# Altium project PROC101D_SCH_With_Design_Updates..Notes_V1.0.PrjPcb (part 10 of 23)

## Sheet 23.SchDoc
size 513 x 386 mm
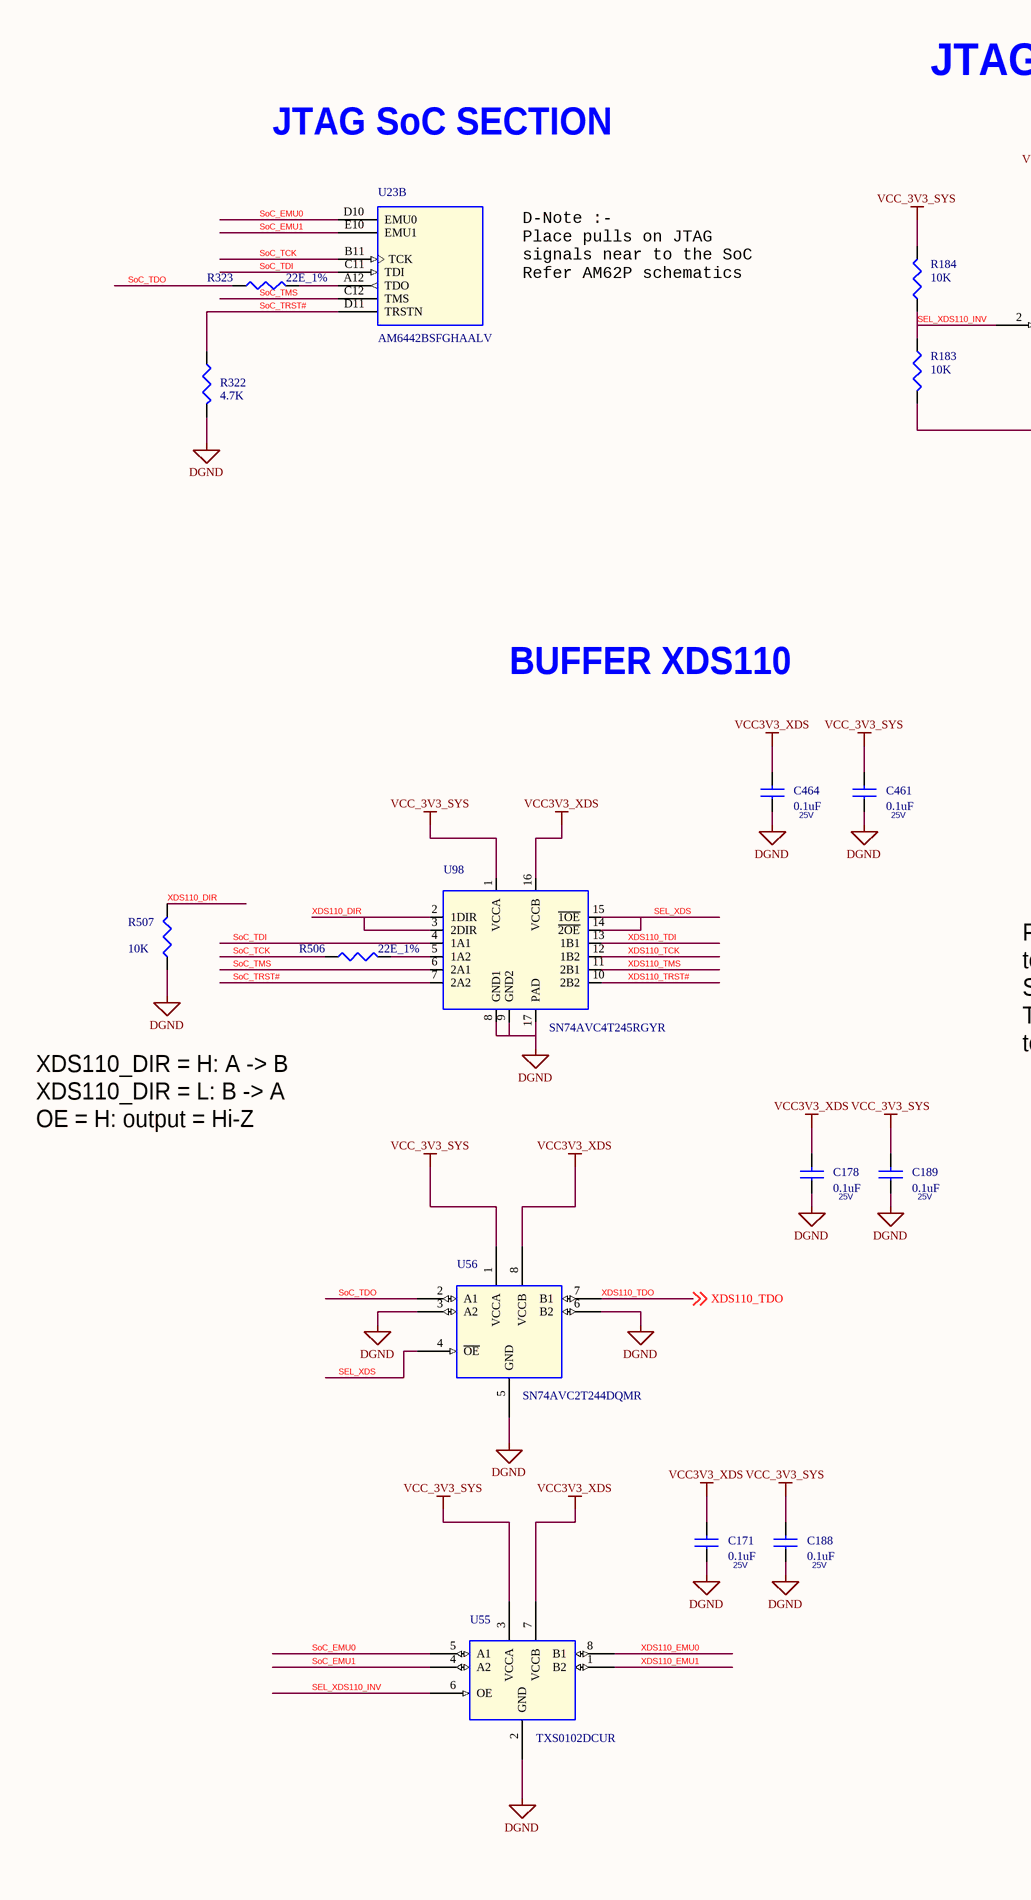
[diagram p36: 23.SchDoc, left]
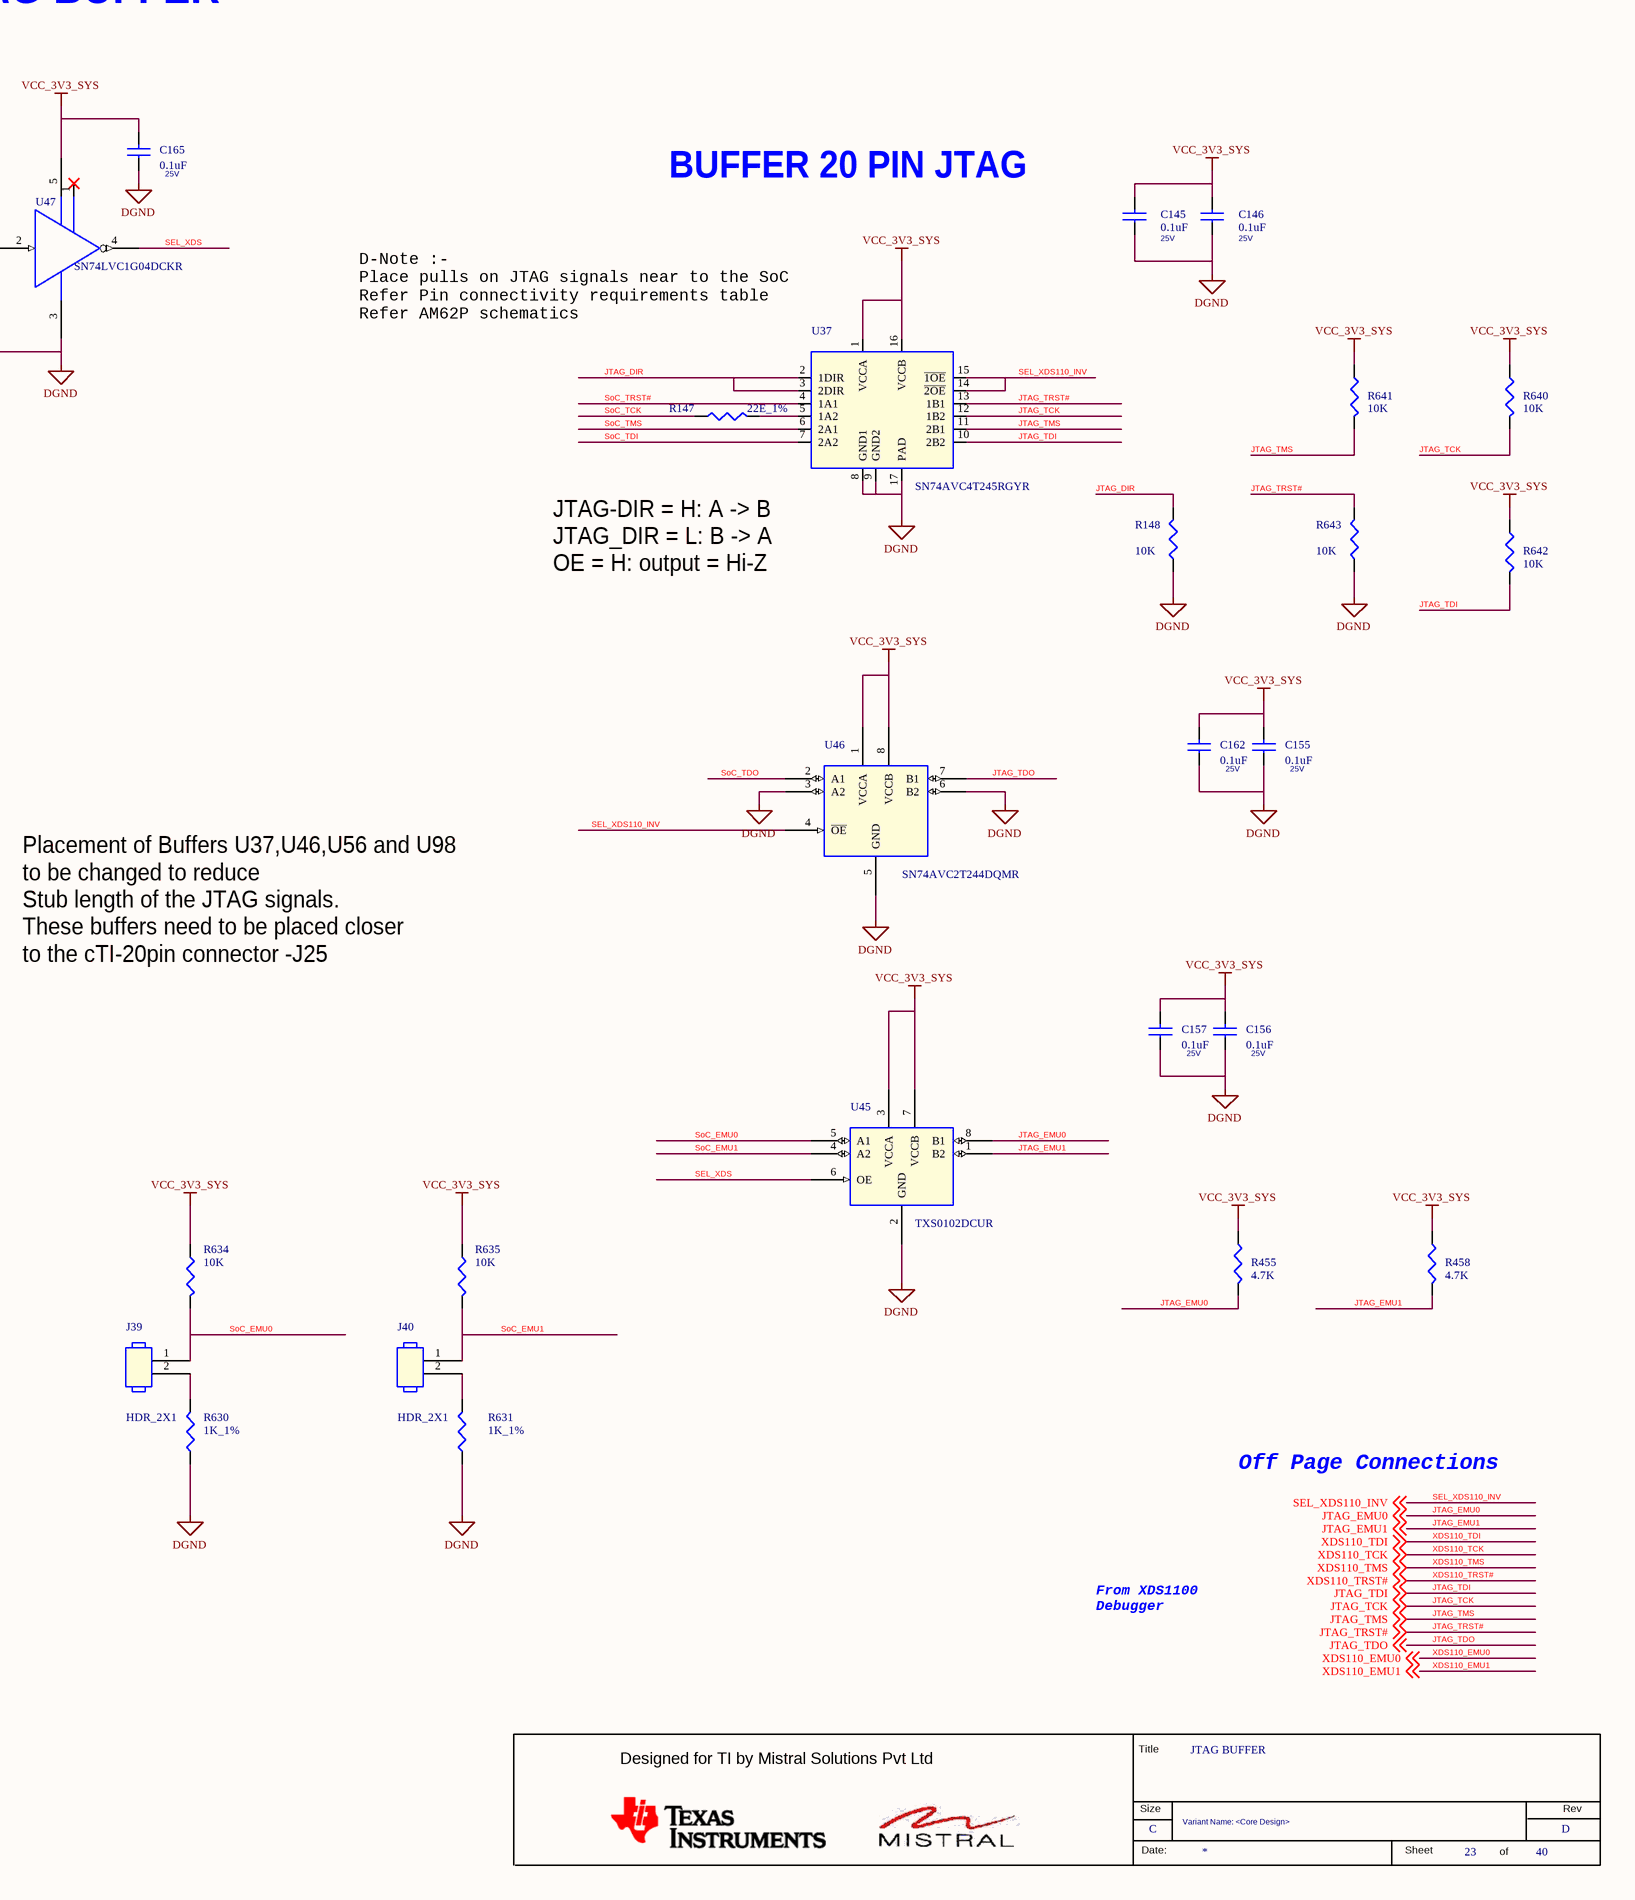
[diagram p37: 23.SchDoc, right]

### Parts
(Parts that share a designator on the sheet are numbered #1, #2 ... from top to bottom, then left to right.)
*#23  RevCode: D  Title: JTAG BUFFER  Page Size: C  Page Number: 23  Page Count: 40  Variant Name: <Core Design>  (hidden comment: MISTRAL_TITLEBLK_CSIZE)  (graphical)
C145  0.1uF  Voltage: 25V  [CAP0402_0-75]
C146  0.1uF  Voltage: 25V  [CAP0402_0-75]
C155  0.1uF  Voltage: 25V  [CAP0402_0-75]
C156  0.1uF  Voltage: 25V  [CAP0402_0-75]
C157  0.1uF  Voltage: 25V  [CAP0402_0-75]
C162  0.1uF  Voltage: 25V  [CAP0402_0-75]
C165  0.1uF  Voltage: 25V  [CAP0402_0-75]
C171  0.1uF  Voltage: 25V  [CAP0402_0-75]
C178  0.1uF  Voltage: 25V  [CAP0402_0-75]
C188  0.1uF  Voltage: 25V  [CAP0402_0-75]
C189  0.1uF  Voltage: 25V  [CAP0402_0-75]
C461  0.1uF  Voltage: 25V  [CAP0402_0-75]
C464  0.1uF  Voltage: 25V  [CAP0402_0-75]
J39  HDR_2X1  [HDR_2X1_100_S_T_10-8]
J40  HDR_2X1  [HDR_2X1_100_S_T_10-8]
R147  22E_1%  [RES0402_0-5]
R148  10K  [RES0402_0-5]
R183  10K  [RES0402_0-5]
R184  10K  [RES0402_0-5]
R322  4.7K  [RES0402_0-5]
R323  22E_1%  [RES0402_0-5]
R455  4.7K  [RES0402_0-5]
R458  4.7K  [RES0402_0-5]
R506  22E_1%  [RES0402_0-5]
R507  10K  [RES0402_0-5]
R630  1K_1%  [RES0402_0-5]
R631  1K_1%  [RES0402_0-5]
R634  10K  [RES0402_0-5]
R635  10K  [RES0402_0-5]
R640  10K  [RES0402_0-5]
R641  10K  [RES0402_0-5]
R642  10K  [RES0402_0-5]
R643  10K  [RES0402_0-5]
U23  AM6442BSFGHAALV  [FCBGA441_31-49_680X680_2-6]  (part B of 16)
U37  SN74AVC4T245RGYR  [QFN16_19-68_160X140]
U45  TXS0102DCUR  [VSSOP8_19-68_85X95_0-9]
U46  SN74AVC2T244DQMR  [X2SON8_15-74_70X50]
U47  SN74LVC1G04DCKR  [SC70-5]
U55  TXS0102DCUR  [VSSOP8_19-68_85X95_0-9]
U56  SN74AVC2T244DQMR  [X2SON8_15-74_70X50]
U98  SN74AVC4T245RGYR  [QFN16_19-68_160X140]

### Nets
DGND: C145.1 C146.1 C155.1 C156.1 C157.1 C162.1 C165.1 C171.1 C178.1 C188.1 C189.1 C461.1 C464.1 R148.1 R183.2 R322.2 R507.1 R630.1 R631.1 R643.1 U37.8(GND1) U37.9(GND2) U37.17(PAD) U45.2(GND) U46.3(A2) U46.5(GND) U46.6(B2) U47.3(GND) U55.2(GND) U56.3(A2) U56.5(GND) U56.6(B2) U98.8(GND1) U98.9(GND2) U98.17(PAD)
VCC3V3_XDS: C171.2 C178.2 C464.2 U55.7(VCCB) U56.8(VCCB) U98.16(VCCB)
VCC_3V3_SYS: C145.2 C146.2 C155.2 C156.2 C157.2 C162.2 C165.2 C188.2 C189.2 C461.2 R184.2 R455.1 R458.1 R634.1 R635.1 R640.1 R641.1 R642.1 U37.1(VCCA) U37.16(VCCB) U45.3(VCCA) U45.7(VCCB) U46.1(VCCA) U46.8(VCCB) U47.5(VCC) U55.3(VCCA) U56.1(VCCA) U98.1(VCCA)
JTAG_DIR: R148.2 U37.2(1DIR) U37.3(2DIR)
JTAG_EMU0: R455.2 U45.8(B1) ; off-sheet JTAG_EMU0
JTAG_EMU1: R458.2 U45.1(B2) ; off-sheet JTAG_EMU1
JTAG_TCK: R640.2 U37.12(1B2) ; off-sheet JTAG_TCK
JTAG_TDI: R642.2 U37.10(2B2) ; off-sheet JTAG_TDI
JTAG_TDO: U46.7(B1) ; off-sheet JTAG_TDO
JTAG_TMS: R641.2 U37.11(2B1) ; off-sheet JTAG_TMS
JTAG_TRST#: R643.2 U37.13(1B1) ; off-sheet JTAG_TRST#
SEL_XDS: U45.6(OE) U47.4(Y) U56.4(~{OE}) U98.14(~{2OE}) U98.15(~{1OE})
SEL_XDS110_INV: R183.1 R184.1 U37.14(~{2OE}) U37.15(~{1OE}) U46.4(~{OE}) U47.2(A) U55.6(OE) ; off-sheet SEL_XDS110_INV
SoC_EMU0: J39.1 R634.2 U23.D10(EMU0) U45.5(A1) U55.5(A1)
SoC_EMU1: J40.1 R635.2 U23.E10(EMU1) U45.4(A2) U55.4(A2)
SoC_TCK: R147.2 R506.2 U23.B11(TCK)
SoC_TDI: U23.C11(TDI) U37.7(2A2) U98.4(1A1)
SoC_TDO: R323.1 U46.2(A1) U56.2(A1)
SoC_TMS: U23.C12(TMS) U37.6(2A1) U98.6(2A1)
SoC_TRST#: R322.1 U23.D11(TRSTN) U37.4(1A1) U98.7(2A2)
XDS110_DIR: R507.2 U98.2(1DIR) U98.3(2DIR)
XDS110_EMU0: U55.8(B1) ; off-sheet XDS110_EMU0
XDS110_EMU1: U55.1(B2) ; off-sheet XDS110_EMU1
XDS110_TCK: U98.12(1B2) ; off-sheet XDS110_TCK
XDS110_TDI: U98.13(1B1) ; off-sheet XDS110_TDI
XDS110_TDO: U56.7(B1) ; off-sheet XDS110_TDO
XDS110_TMS: U98.11(2B1) ; off-sheet XDS110_TMS
XDS110_TRST#: U98.10(2B2) ; off-sheet XDS110_TRST#
NetJ39_2: J39.2 R630.2
NetJ40_2: J40.2 R631.2
NetR147_1: R147.1 U37.5(1A2)
NetR323_2: R323.2 U23.A12(TDO)
NetR506_1: R506.1 U98.5(1A2)

Not connected (* = marked no-connect by the designer): U47 1(NC)*

### Notes on the sheet
- JTAG BUFFER
- JTAG SoC SECTION
- D-Note :-
  Place pulls on JTAG
  signals near to the SoC
  Refer AM62P schematics
- BUFFER 20 PIN JTAG
- (near U37) D-Note :-
  Place pulls on JTAG signals near to the SoC
  Refer Pin connectivity requirements table
  Refer AM62P schematics
- (near U37) JTAG-DIR = H: A -> B
  JTAG_DIR = L: B -> A
  OE = H: output = Hi-Z
- BUFFER XDS110
- Placement of Buffers U37,U46,U56 and U98
  to be changed to reduce
  Stub length of the JTAG signals.
  These buffers need to be placed closer
  to the cTI-20pin connector -J25
- XDS110_DIR = H: A -> B
  XDS110_DIR = L: B -> A
  OE = H: output = Hi-Z
- Off Page Connections
- From XDS1100
  Debugger
- (in symbol MISTRAL_TITLEBLK_CSIZE) Title; Designed for TI by Mistral Solutions Pvt Ltd; Size; Rev; Date:; Sheet; of

### Library data of the parts
*#23 = MISTRAL_TITLEBLK_CSIZE: Issue: 1.0; Page Create Date: March  8, 1995; Page Modify Date: *
C145 C146 C155 C156 C171 C178 C188 C189 C461 C464 = CAP_Dup3: as C185 on sheet 22; Tolerance: 20%; Package: 0402; Distributor_name: DIGIKEY; Distributor_part_number: 732-7495-1-ND; Height: 0.55MM; Weight: 0.65mg; Temperature: -55癈+85癈; Datasheet: Y:\MIS_DATABASE\DATASHEETS\CAPACITORS\885012105018.PDF; Crtd /date: ALVY/170820; Chkd/date: MANIRAJA/170820; MECHANICAL 3D STEP FILE: CAP0402_0-75; Library Ref: CAP; Footprint Ref: CAP0402_0-75; Library Path: Y:\MIS_DATABASE\Library\ALTIUM_TOOL\SCHEMATICS_PARTS\MS_DISCRETE_Library.schlib; Footprint Path: Y:\MIS_DATABASE\Library\ALTIUM_TOOL\PCB_FOOTPRINTS\Altium_Footprint_Lib.PcbLib; PCB Footprint: CAP0402_0-75
C157 C162 C165 = CAP_Dup3: as C192 on sheet 22; Footprint Path: Y:\MIS_DATABASE\Library\ALTIUM_TOOL\PCB_FOOTPRINTS\Altium_Footprint_Lib.PcbLib; Library Path: Y:\MIS_DATABASE\Library\ALTIUM_TOOL\SCHEMATICS_PARTS\MS_DISCRETE_Library.schlib; Footprint Ref: CAP0402_0-75; Library Ref: CAP; MECHANICAL 3D STEP FILE: CAP0402_0-75; Chkd/date: MANIRAJA/170820; Crtd /date: ALVY/170820; Datasheet: Y:\MIS_DATABASE\DATASHEETS\CAPACITORS\885012105018.PDF; Temperature: -55癈+85癈; Weight: 0.65mg; Height: 0.55MM; Distributor_part_number: 732-7495-1-ND; Distributor_name: DIGIKEY; Package: 0402; Tolerance: 20%; PCB Footprint: CAP0402_0-75
J39 J40 = HEADER_2X1_Dup1: CON HDR 2X1 2.54MM PITCH ST TH; Mistral Part No: 150009030246-R; Mfr_name: MOLEX; Part_type: CONNECTOR\HEADERS; Wattage: NA; Project: FPGA EXTENDER CARD; Customs_HS_Code: 85369090; Custom_Duty: 24%; PCB Footprint: HDR_2X1_100_S_T_10-8; Footprint Ref: HDR_2X1_100_S_T_10-8; Library Ref: HEADER_2X1; Footprint Path: Y:\MIS_DATABASE\Library\ALTIUM_TOOL\PCB_FOOTPRINTS\Altium_Footprint_Lib.PcbLib; Library Path: Y:\MIS_DATABASE\Library\ALTIUM_TOOL\SCHEMATICS_PARTS\MS_Connector_Library.schlib; MECHANICAL 3D STEP FILE: HDR_2X1_100_S_T_10-8; Temperature: -0癈+75癈; Weight: 139gm; Voltage: NA; Tolerance: NA; Mfr_part_number: 22-03-2021; Package: THRU-HOLE; Distributor_name: DIGIKEY; Distributor_part_number: WM4000-ND; Height: 10.79MM; Datasheet: Y:\MIS_DATABASE\DATASHEETS\CONNECTORS\HEADER_X4030.PDF; Crtd /date: MAZHAR/280405; Chkd/date: VASANTHA/060117
R147 R323 = RESISTOR_Dup5: RES 22E 1/16W 1% 0402; Mistral Part No: 110009090004-R; Mfr_name: YAGEO AMERICA; Mfr_part_number: RC0402FR-0722RL; Part_type: RESISTORS\FIXED; Cust_part_number: 4700-80047E; SIGNAL_MODEL: RESISTOR_RES0402_22E_22E; Project: VMEFMCD; Voltage: NA; Customs_HS_Code: 85332119; Custom_Duty: 15%; Library Ref: RESISTOR; Tolerance: 1%; Wattage: 1/16W; Package: 0402; Distributor_name: DIGIKEY; Distributor_part_number: 311-22.0LRCT-ND; Height: 0.40MM; Weight: 0.65mg; Temperature: -55癈+155癈; Datasheet: Y:\MIS_DATABASE\DATASHEETS\RESISTORS\RCXXXXL-SER_MAR18.PDF; Crtd /date: MAZHAR/090909; Chkd/date: SUHAS/290910; Footprint Ref: RES0402_0-5; PCB Footprint: RES0402_0-5; MECHANICAL 3D STEP FILE: RES0402_0-5; Library Path: Y:\MIS_DATABASE\Library\ALTIUM_TOOL\SCHEMATICS_PARTS\MS_DISCRETE_Library.schlib; Footprint Path: Y:\MIS_DATABASE\Library\ALTIUM_TOOL\PCB_FOOTPRINTS\Altium_Footprint_Lib.PcbLib
R148 R183 R507 R634 R635 R640 = RESISTOR_Dup6: as R198 on sheet 22; Footprint Path: Y:\MIS_DATABASE\Library\ALTIUM_TOOL\PCB_FOOTPRINTS\Altium_Footprint_Lib.PcbLib; Library Path: Y:\MIS_DATABASE\Library\ALTIUM_TOOL\SCHEMATICS_PARTS\MS_DISCRETE_Library.schlib; Footprint Ref: RES0402_0-5; Library Ref: RESISTOR; Tolerance: 5%; Wattage: 1/16W; Package: 0402; Distributor_name: DIGIKEY; Distributor_part_number: 311-10KJRCT-ND; Height: 0.40MM; Weight: 0.65mg; Temperature: -55癈+155癈; Datasheet: Y:\MIS_DATABASE\DATASHEETS\RESISTORS\RCXXXXL-SER_MAR18.PDF; Crtd /date: MAZHAR/230805; Chkd/date: VASANTHA/061216; MECHANICAL 3D STEP FILE: RES0402_0-5; PCB Footprint: RES0402_0-5
R184 R641-R643 = RESISTOR_Dup6: as R199 on sheet 22; PCB Footprint: RES0402_0-5; MECHANICAL 3D STEP FILE: RES0402_0-5; Chkd/date: VASANTHA/061216; Crtd /date: MAZHAR/230805; Datasheet: Y:\MIS_DATABASE\DATASHEETS\RESISTORS\RCXXXXL-SER_MAR18.PDF; Temperature: -55癈+155癈; Weight: 0.65mg; Height: 0.40MM; Distributor_part_number: 311-10KJRCT-ND; Distributor_name: DIGIKEY; Package: 0402; Wattage: 1/16W; Tolerance: 5%; Library Ref: RESISTOR; Footprint Ref: RES0402_0-5; Library Path: Y:\MIS_DATABASE\Library\ALTIUM_TOOL\SCHEMATICS_PARTS\MS_DISCRETE_Library.schlib; Footprint Path: Y:\MIS_DATABASE\Library\ALTIUM_TOOL\PCB_FOOTPRINTS\Altium_Footprint_Lib.PcbLib
R322 = RESISTOR_Dup4: as R202 on sheet 22; Tolerance: 5%; Wattage: 1/16W; Package: 0402; Distributor_name: DIGIKEY; Distributor_part_number: 311-4.7KJRCT-ND; Height: 0.40MM; Weight: 0.65mg; Temperature: -55癈+155癈; Datasheet: Y:\MIS_DATABASE\DATASHEETS\RESISTORS\RCXXXXL-SER_MAR18.PDF; Crtd /date: VASANTHA/130516; Chkd/date: VASANTHA/130516; Library Ref: RESISTOR; Footprint Ref: RES0402_0-5; PCB Footprint: RES0402_0-5; MECHANICAL 3D STEP FILE: RES0402_0-5; Library Path: Y:\MIS_DATABASE\Library\ALTIUM_TOOL\SCHEMATICS_PARTS\MS_DISCRETE_Library.schlib; Footprint Path: Y:\MIS_DATABASE\Library\ALTIUM_TOOL\PCB_FOOTPRINTS\Altium_Footprint_Lib.PcbLib
R455 R458 = RESISTOR_Dup4: as R203 on sheet 22; PCB Footprint: RES0402_0-5; Library Ref: RESISTOR; Chkd/date: VASANTHA/130516; Crtd /date: VASANTHA/130516; Datasheet: Y:\MIS_DATABASE\DATASHEETS\RESISTORS\RCXXXXL-SER_MAR18.PDF; Temperature: -55癈+155癈; Weight: 0.65mg; Height: 0.40MM; Distributor_part_number: 311-4.7KJRCT-ND; Distributor_name: DIGIKEY; Package: 0402; Wattage: 1/16W; Tolerance: 5%; Footprint Ref: RES0402_0-5; MECHANICAL 3D STEP FILE: RES0402_0-5; Library Path: Y:\MIS_DATABASE\Library\ALTIUM_TOOL\SCHEMATICS_PARTS\MS_DISCRETE_Library.schlib; Footprint Path: Y:\MIS_DATABASE\Library\ALTIUM_TOOL\PCB_FOOTPRINTS\Altium_Footprint_Lib.PcbLib
R506 = RESISTOR_Dup5: RES 22E 1/16W 1% 0402; Cust_part_number: 4700-80047E; Part_type: RESISTORS\FIXED; Mfr_part_number: RC0402FR-0722RL; Mfr_name: YAGEO AMERICA; Mistral Part No: 110009090004-R; Custom_Duty: 15%; Customs_HS_Code: 85332119; Voltage: NA; Project: VMEFMCD; SIGNAL_MODEL: RESISTOR_RES0402_22E_22E; Library Ref: RESISTOR; Chkd/date: SUHAS/290910; Crtd /date: MAZHAR/090909; Datasheet: Y:\MIS_DATABASE\DATASHEETS\RESISTORS\RCXXXXL-SER_MAR18.PDF; Temperature: -55癈+155癈; Weight: 0.65mg; Height: 0.40MM; Distributor_part_number: 311-22.0LRCT-ND; Distributor_name: DIGIKEY; Package: 0402; Wattage: 1/16W; Tolerance: 1%; Footprint Ref: RES0402_0-5; PCB Footprint: RES0402_0-5; MECHANICAL 3D STEP FILE: RES0402_0-5; Library Path: Y:\MIS_DATABASE\Library\ALTIUM_TOOL\SCHEMATICS_PARTS\MS_DISCRETE_Library.schlib; Footprint Path: Y:\MIS_DATABASE\Library\ALTIUM_TOOL\PCB_FOOTPRINTS\Altium_Footprint_Lib.PcbLib
R630 R631 = RESISTOR_Dup5: RES 1K 1/10W 1% 0402; Mistral Part No: 110009030411-R; Mfr_name: PANASONIC-ECG; Mfr_part_number: ERJ-2RKF1001X; Part_type: RESISTORS\FIXED; Project: VOCERA; Voltage: NA; Customs_HS_Code: 85332119; Custom_Duty: 15%; PCB Footprint: RES0402_0-5; Footprint Path: Y:\MIS_DATABASE\Library\ALTIUM_TOOL\PCB_FOOTPRINTS\Altium_Footprint_Lib.PcbLib; Library Path: Y:\MIS_DATABASE\Library\ALTIUM_TOOL\SCHEMATICS_PARTS\MS_DISCRETE_Library.schlib; MECHANICAL 3D STEP FILE: RES0402_0-5; Footprint Ref: RES0402_0-5; Library Ref: RESISTOR; Tolerance: 1%; Wattage: 1/10W; Package: 0402; Distributor_name: DIGIKEY; Distributor_part_number: P1.00KLCT-ND; Height: 0.40MM; Weight: 0.8mg; Temperature: -55癈+155癈; Datasheet: Y:\MIS_DATABASE\DATASHEETS\RESISTORS\PAN-ERJSER_NOV17.PDF; Crtd /date: MAZHAR/150506; Chkd/date: VASANTHA/281216
U23 = XAM6442BSFGGAALV_BGA441: IC AM64x SoC MICROPROCESSOR BGA441; Mistral Part No: 141220080002; Mfr_name: TEXAS INSTRUMENTS; Part_type: ICS\DIGITAL\MICROPROCESSOR; Project: AM64x-GP_EVM BRD; Tolerance: NA; Customs_HS_Code: 85423100; Custom_Duty: 15%; PCB Footprint: FCBGA441_31-49_680X680_2-6; Footprint Ref: FCBGA441_31-49_680X680_2-6; Mfr_part_number: AM6442BSFGHAALV; Voltage: NA; Wattage: NA; Package: BGA441; Distributor_name: NA; Distributor_part_number: NA; Library Ref: XAM6442BSFGGAALV_BGA441; Height: 2.57MM; Weight: NA; Temperature: NA; Datasheet: Y:\MIS_DATABASE\DATASHEETS\ICS\DIGITAL\MICROCONTROLLER\AM64-SoC_SVB.PDF; Crtd /date: ALVY/300322; Chkd/date: ALVY/300322; RoHS: NA; MECHANICAL 3D STEP FILE: FCBGA441_31-49_680X680_2-6; Library Path: Y:\MIS_DATABASE\Library\ALTIUM_TOOL\SCHEMATICS_PARTS\MS_MICROPROCESSOR_Library.schlib; Footprint Path: Y:\MIS_DATABASE\Library\ALTIUM_TOOL\PCB_FOOTPRINTS\Altium_Footprint_Lib.PcbLib
U37 = SN74AVC4T245RGYR_QFN16: IC 4-BIT DUAL SUPPLY BUS TRANSCEIVER QFN16; Mistral Part No: 141009030112-R; Mfr_name: TEXAS INSTRUMENTS; Part_type: ICS\DIGITAL\COMBINATIONAL; Project: HS100RD; Customs_HS_Code: 85423100; Custom_Duty: 15%; PCB Footprint: QFN16_19-68_160X140; Mfr_part_number: SN74AVC4T245RGYR; Package: QFN16; Distributor_name: DIGIKEY; Distributor_part_number: 296-18231-1-ND; Height: 1.00MM; Datasheet: Y:\MIS_DATABASE\DATASHEETS\ICS\DIGITAL\BUSTRANSCEIVER\SN74AVC4T245XXXX.PDF; Crtd /date: USMAN/060308; Chkd/date: MAZHAR/060308; RoHS: Sb/ Br FREE; Library Ref: SN74AVC4T245RGYR_QFN16
U45 = TXS0102DCUR_VSSOP8: IC 2BIT BI-DIR VOLTAGE-LEVEL TRANSLATOR US8(VSSOP8); Mistral Part No: 141009030376-R; Mfr_name: TEXAS INSTRUMENTS; Part_type: ICS\INTERFACE\LEVEL TRANSLATOR; Project: SD_WATERLOO; Tolerance: NA; Customs_HS_Code: 85423100; Custom_Duty: 15%; PCB Footprint: VSSOP8_19-68_85X95_0-9; Mfr_part_number: TXS0102DCUR; Voltage: NA; Wattage: NA; Package: US8; Distributor_name: DIGIKEY; Distributor_part_number: 296-21931-1-ND; Height: 0.90MM; Weight: 9.6mg; Temperature: -40癈+85癈; Datasheet: Y:\MIS_DATABASE\DATASHEETS\ICS\INTERFACE\TXS0102.PDF; Crtd /date: SHREESHAIL/190108; Chkd/date: MANIRAJA/130617; MECHANICAL 3D STEP FILE: VSSOP8_19-68_85X95_0-9; Library Path: Y:\MIS_DATABASE\Library\ALTIUM_TOOL\SCHEMATICS_PARTS\MS_MISCINTERFACE_Library.schlib; Footprint Path: Y:\MIS_DATABASE\Library\ALTIUM_TOOL\PCB_FOOTPRINTS\Altium_Footprint_Lib.PcbLib; Library Ref: TXS0102DCUR_VSSOP8; Footprint Ref: VSSOP8_19-68_85X95_0-9
U46 U56 = SN74AVC2T244DQMR_X2SON8: IC 2-BIT UNDIRECTIONAL VOLTAGE-LEVEL TRANSLATOR X2SON8; Part_type: ICS\INTERFACE\LEVEL TRANSLATOR; Mfr_name: TEXAS INSTRUMENTS; Mistral Part No: 141016030002-R; Customs_HS_Code: 15%; Pb-Free: 85423100; Wattage: NA; Project: OCTASIC_3600; PCB Footprint: X2SON8_15-74_70X50; Chkd/date: VASANTHA/060516; Crtd /date: VASANTHA/030316; Datasheet: Y:\MIS_DATABASE\DATASHEETS\ICS\INTERFACE\SN74AVC2T244.PDF; Temperature: -40癈+85癈; Weight: NA; Height: 0.40MM; Distributor_part_number: 296-29674-1-ND; Distributor_name: DIGIKEY; Package: X2SON8; Voltage: NA; Tolerance: NA; Mfr_part_number: SN74AVC2T244DQMR; Library Ref: SN74AVC2T244DQMR_X2SON8
U47 = SN74LVC1G04DCKR_SC70-5: IC SINGLE INVERTER GATE SC70-5; Mistral Part No: 141009070007-R; Mfr_name: TEXAS INSTRUMENTS; Part_type: ICS\DIGITAL\GATES; Project: BUG_BASE-II; Customs_HS_Code: 85423100; Custom_Duty: 15%; PCB Footprint: SC70-5; Library Ref: SN74LVC1G04DCKR_SC70-5; Mfr_part_number: SN74LVC1G04DCKR; Package: SC70-5; Distributor_name: DIGIKEY; Distributor_part_number: 296-11600-1-ND; Height: 1.10MM; Temperature: -40癈+85癈; Datasheet: Y:\MIS_DATABASE\DATASHEETS\ICS\DIGITAL\GATES\SN74LVC1G04-1.PDF; Crtd /date: USMAN/150709; Chkd/date: SUHAS/221010; RoHS: Sb/ Br FREE
U55 = TXS0102DCUR_VSSOP8: IC 2BIT BI-DIR VOLTAGE-LEVEL TRANSLATOR US8(VSSOP8); Part_type: ICS\INTERFACE\LEVEL TRANSLATOR; Mfr_name: TEXAS INSTRUMENTS; Mistral Part No: 141009030376-R; Custom_Duty: 15%; Customs_HS_Code: 85423100; Wattage: NA; Project: SD_WATERLOO; PCB Footprint: VSSOP8_19-68_85X95_0-9; Footprint Path: Y:\MIS_DATABASE\Library\ALTIUM_TOOL\PCB_FOOTPRINTS\Altium_Footprint_Lib.PcbLib; Library Path: Y:\MIS_DATABASE\Library\ALTIUM_TOOL\SCHEMATICS_PARTS\MS_MISCINTERFACE_Library.schlib; MECHANICAL 3D STEP FILE: VSSOP8_19-68_85X95_0-9; Chkd/date: MANIRAJA/130617; Crtd /date: SHREESHAIL/190108; Datasheet: Y:\MIS_DATABASE\DATASHEETS\ICS\INTERFACE\TXS0102.PDF; Temperature: -40癈+85癈; Weight: 9.6mg; Height: 0.90MM; Distributor_part_number: 296-21931-1-ND; Distributor_name: DIGIKEY; Package: US8; Voltage: NA; Tolerance: NA; Mfr_part_number: TXS0102DCUR; Library Ref: TXS0102DCUR_VSSOP8; Footprint Ref: VSSOP8_19-68_85X95_0-9
U98 = SN74AVC4T245RGYR_QFN16: IC 4-BIT DUAL SUPPLY BUS TRANSCEIVER QFN16; Part_type: ICS\DIGITAL\COMBINATIONAL; Mfr_name: TEXAS INSTRUMENTS; Mistral Part No: 141009030112-R; Custom_Duty: 15%; Customs_HS_Code: 85423100; Project: HS100RD; PCB Footprint: QFN16_19-68_160X140; RoHS: Sb/ Br FREE; Chkd/date: MAZHAR/060308; Crtd /date: USMAN/060308; Datasheet: Y:\MIS_DATABASE\DATASHEETS\ICS\DIGITAL\BUSTRANSCEIVER\SN74AVC4T245XXXX.PDF; Height: 1.00MM; Distributor_part_number: 296-18231-1-ND; Distributor_name: DIGIKEY; Package: QFN16; Mfr_part_number: SN74AVC4T245RGYR; Library Ref: SN74AVC4T245RGYR_QFN16

## Sheet 24.SchDoc
size 513 x 386 mm
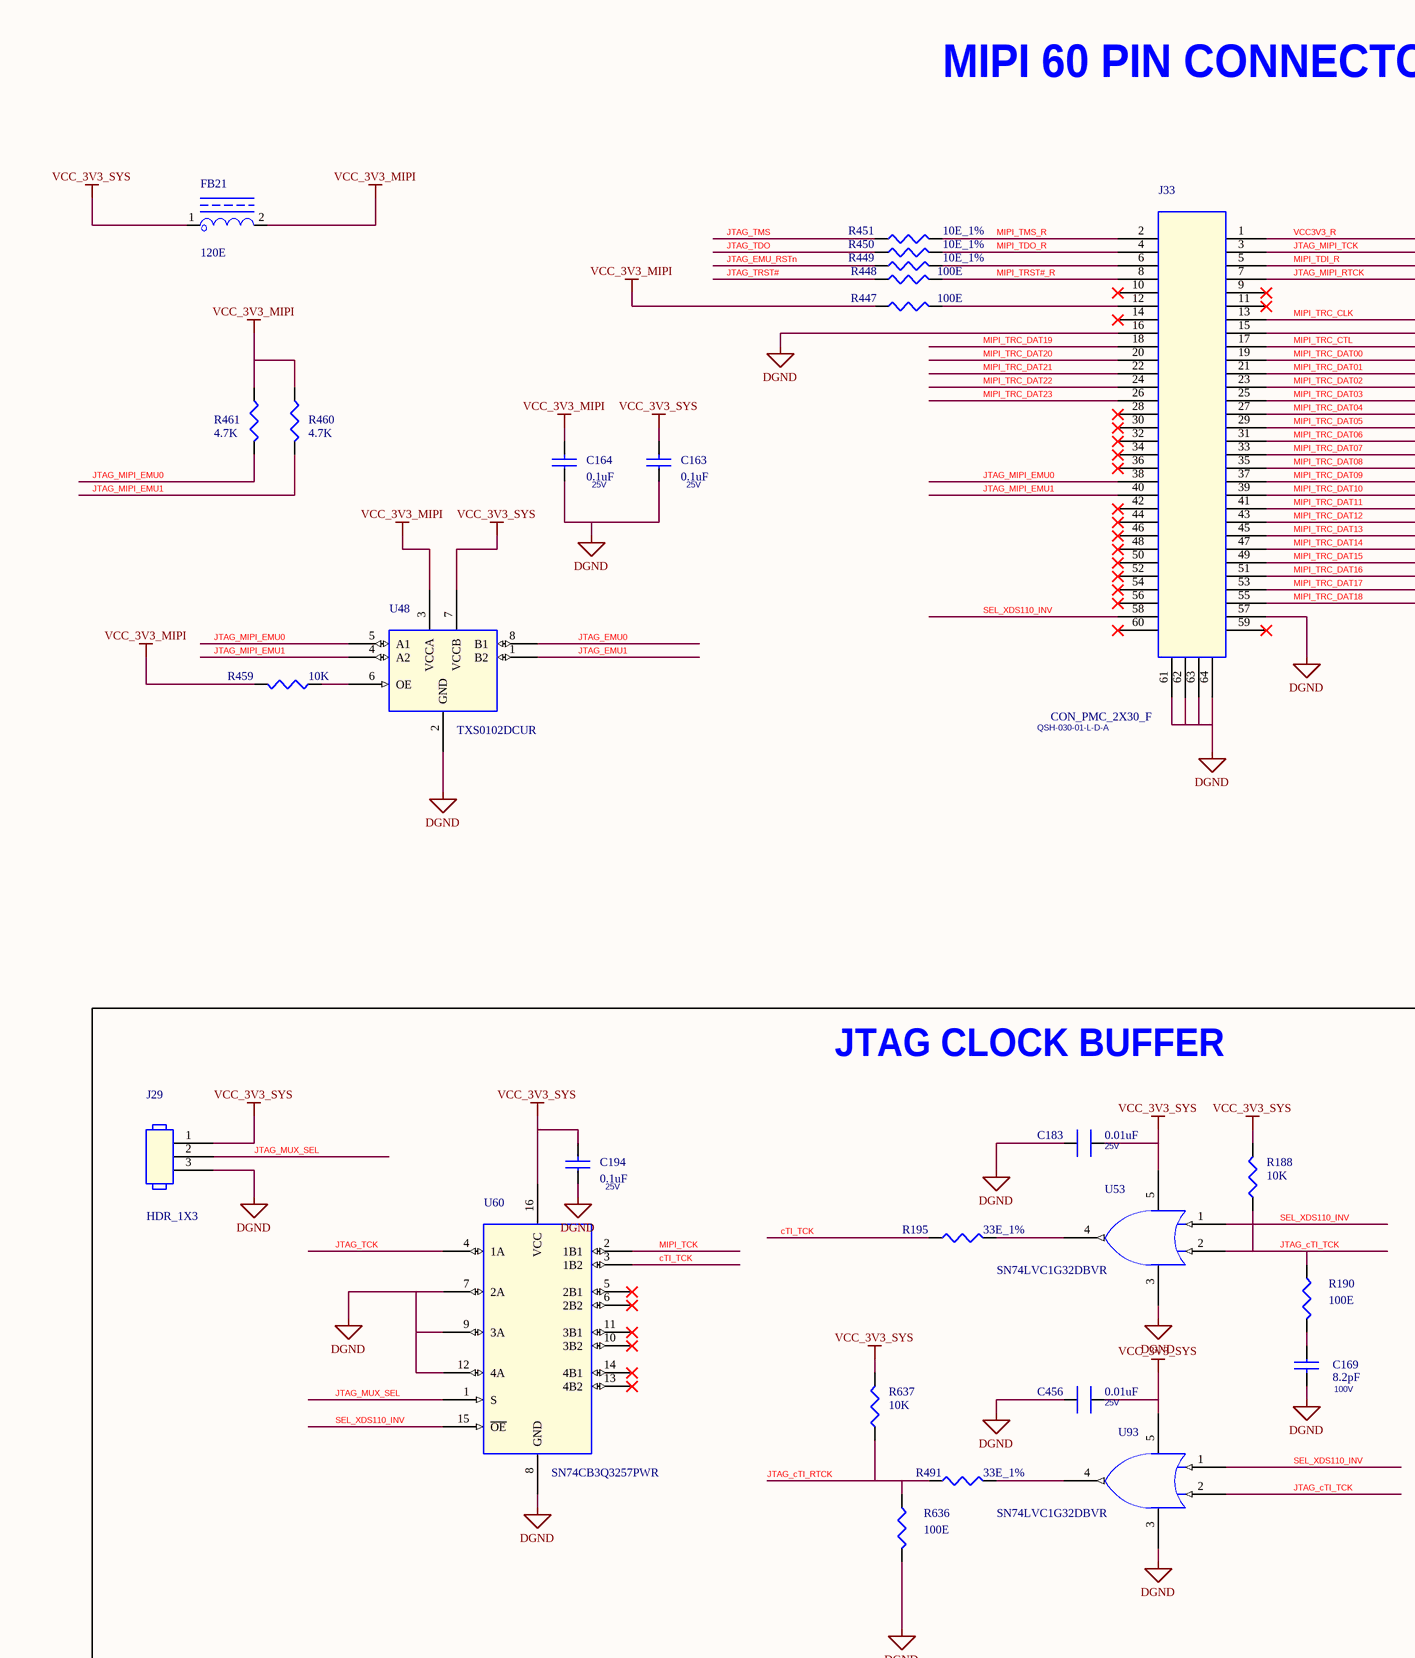
[diagram p38: 24.SchDoc, top left]
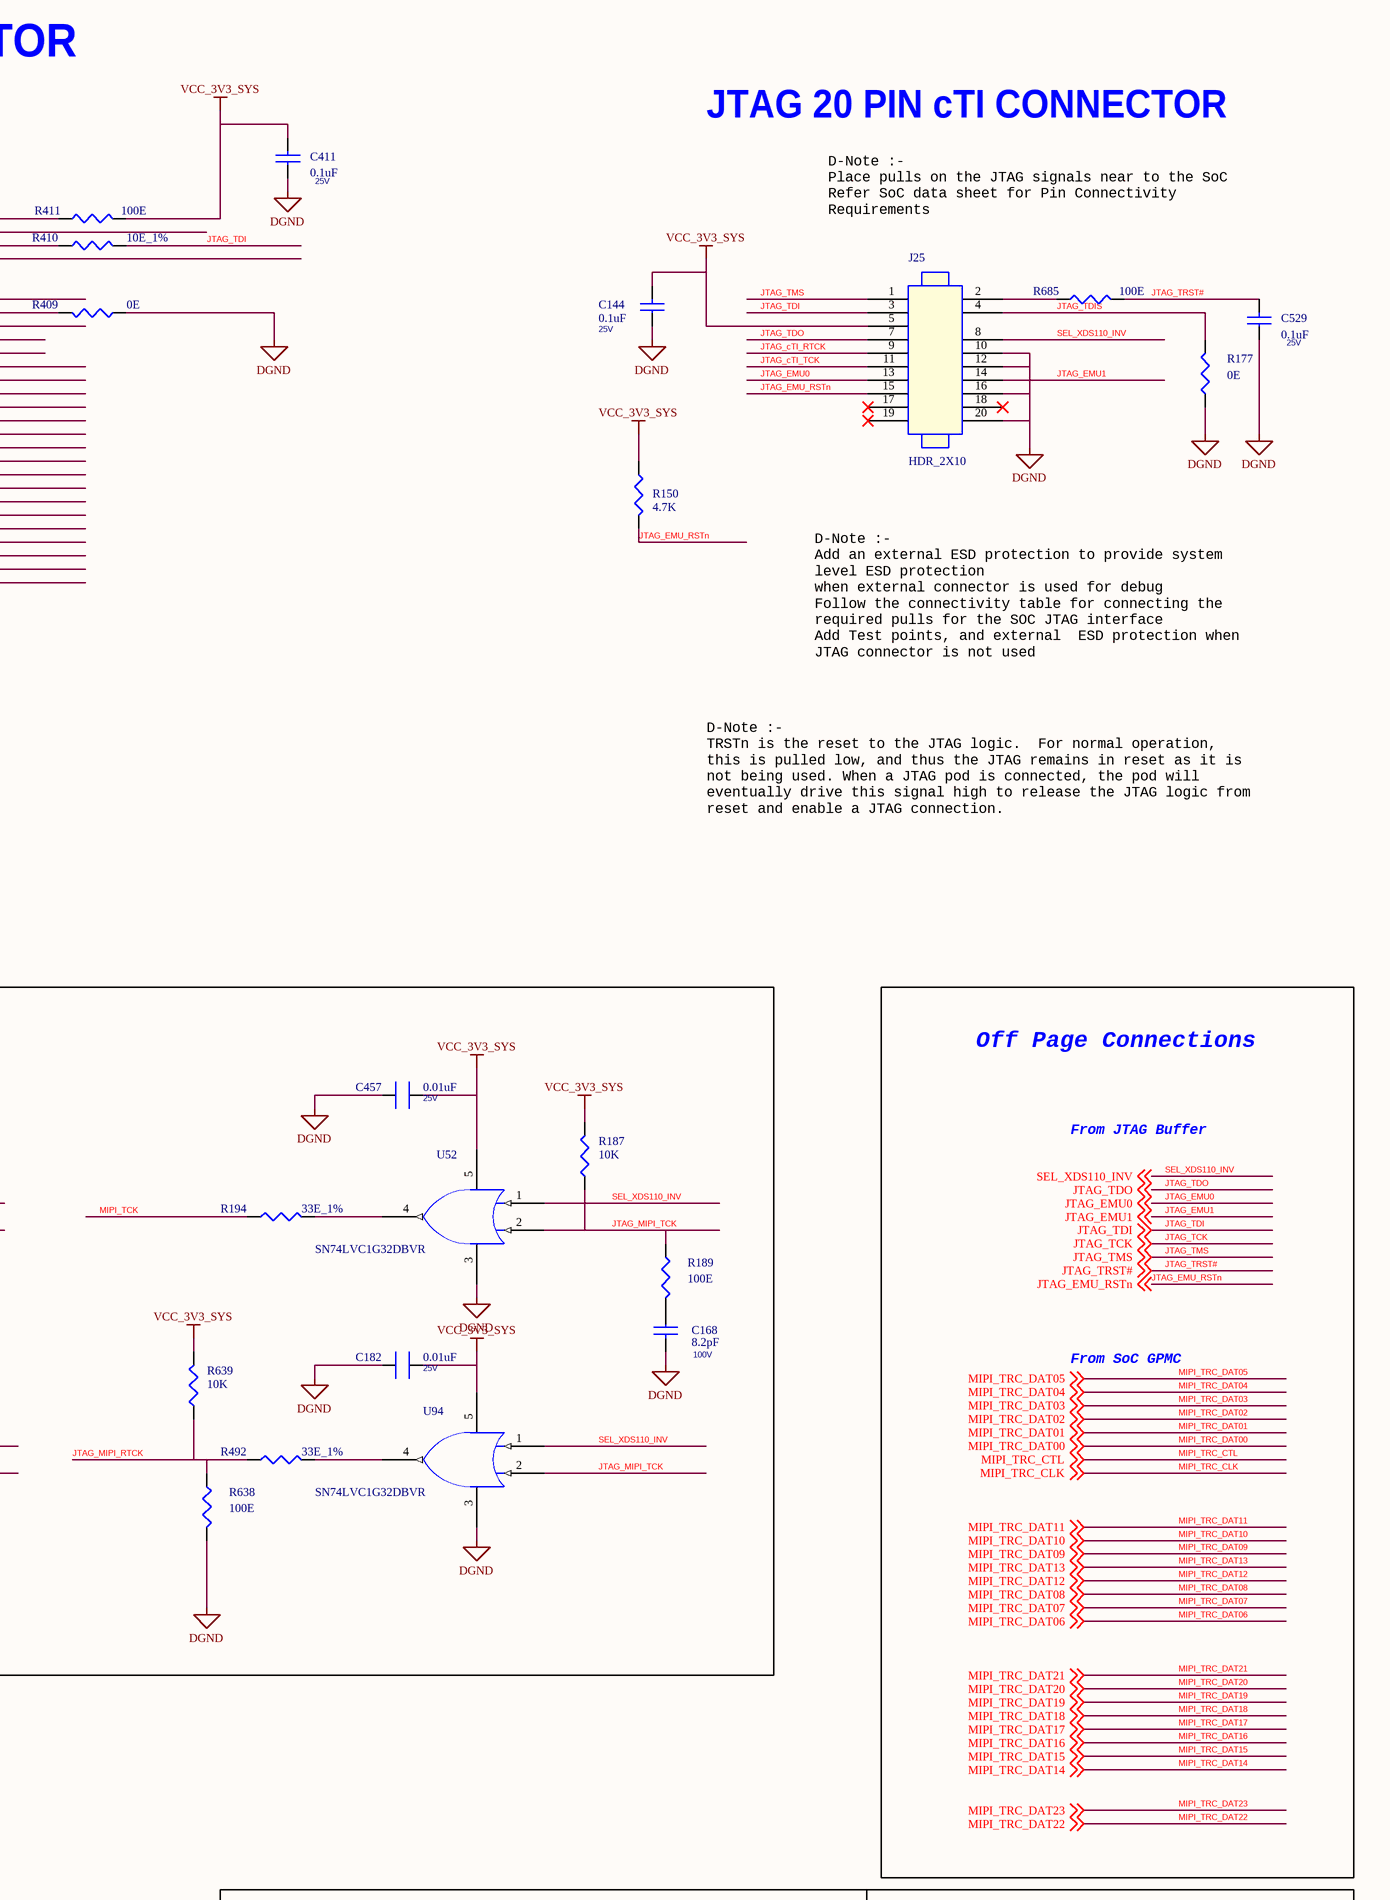
[diagram p39: 24.SchDoc, top right]
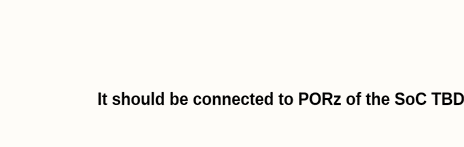
[diagram p40: 24.SchDoc, bottom left]
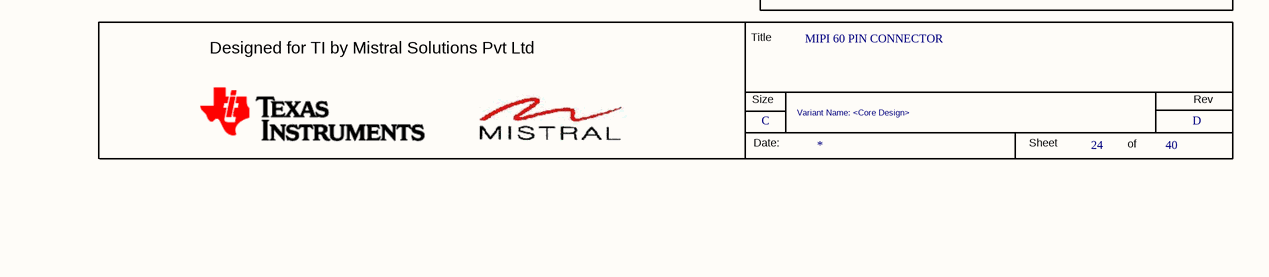
[diagram p41: 24.SchDoc, bottom right]

### Parts
(Parts that share a designator on the sheet are numbered #1, #2 ... from top to bottom, then left to right.)
*#24  RevCode: D  Title: MIPI 60 PIN CONNECTOR  Page Size: C  Page Number: 24  Page Count: 40  Variant Name: <Core Design>  (hidden comment: MISTRAL_TITLEBLK_CSIZE)  (graphical)
C144  0.1uF  Voltage: 25V  [CAP0402_0-75]
C163  0.1uF  Voltage: 25V  [CAP0402_0-75]
C164  0.1uF  Voltage: 25V  [CAP0402_0-75]
C168  8.2pF  Voltage: 100V  [CAP0402_0-75]
C169  8.2pF  Voltage: 100V  [CAP0402_0-75]
C182  0.01uF  Voltage: 25V  [CAP0402N]
C183  0.01uF  Voltage: 25V  [CAP0402N]
C194  0.1uF  Voltage: 25V  [CAP0402_0-75]
C411  0.1uF  Voltage: 25V  [CAP0402_0-75]
C456  0.01uF  Voltage: 25V  [CAP0402N]
C457  0.01uF  Voltage: 25V  [CAP0402N]
C529  0.1uF  Voltage: 25V  [CAP0402_0-75]
FB21  120E  [IND0603_1]
J25  HDR_2X10  [HDR_2X10_FTR-110-51-D-06_S_S_8-7]
J29  HDR_1X3  [HDR_3X1_100_S_T]
J33  CON_PMC_2X30_F  Mfr_part_number: QSH-030-01-L-D-A  [CON_PMC2X30_QSH-030-01-D-A_S_S_S_3-3]
R150  4.7K  [RES0402_0-5]
R177  0E  [RES0402_0-5]
R187  10K  [RES0402_0-5]
R188  10K  [RES0402_0-5]
R189  100E  [RES0402_0-5]
R190  100E  [RES0402_0-5]
R194  33E_1%  [RES0402_0-5]
R195  33E_1%  [RES0402_0-5]
R409  0E  [RES0402N]
R410  10E_1%  [RES0402N]
R411  100E  [RES0402N]
R447  100E  [RES0402N]
R448  100E  [RES0402N]
R449  10E_1%  [RES0402N]
R450  10E_1%  [RES0402N]
R451  10E_1%  [RES0402N]
R459  10K  [RES0402_0-5]
R460  4.7K  [RES0402_0-5]
R461  4.7K  [RES0402_0-5]
R491  33E_1%  [RES0402_0-5]
R492  33E_1%  [RES0402_0-5]
R636  100E  [RES0402_0-5]
R637  10K  [RES0402_0-5]
R638  100E  [RES0402_0-5]
R639  10K  [RES0402_0-5]
R685  100E  [RES0402N]
U48  TXS0102DCUR  [VSSOP8_19-68_85X95_0-9]
U52  SN74LVC1G32DBVR  [SOT23-5_1-5]
U53  SN74LVC1G32DBVR  [SOT23-5_1-5]
U60  SN74CB3Q3257PWR  [TSSOP16_25-59_205X180]
U93  SN74LVC1G32DBVR  [SOT23-5_1-5]
U94  SN74LVC1G32DBVR  [SOT23-5_1-5]

### Blocks framed on the sheet
JTAG CLOCK BUFFER: C168 C169 C182 C183 C194 C456 C457 J29 R187-R190 R194 R195 R491 R492 R636-R639 U52 U53 U60 U93 U94

### Nets
DGND: C144.1 C163.1 C164.1 C168.2 C169.2 C182.1 C183.1 C194.1 C411.1 C456.1 C457.1 C529.1 J25.10 J25.12 J25.16 J25.20 J29.3 J33.16 J33.57 J33.61 J33.62 J33.63 J33.64 R177.1 R409.1 R636.2 R638.2 U48.2(GND) U52.3(GND) U53.3(GND) U60.7(2A) U60.8(GND) U60.9(3A) U60.12(4A) U93.3(GND) U94.3(GND)
VCC_3V3_MIPI: C164.2 FB21.2 R447.1 R459.2 R460.1 R461.1 U48.3(VCCA)
VCC_3V3_SYS: C144.2 C163.2 C182.2 C183.2 C194.2 C411.2 C456.2 C457.2 FB21.1 J25.5 J29.1 R150.1 R187.2 R188.2 R411.2 R637.2 R639.2 U48.7(VCCB) U52.5(VCC) U53.5(VCC) U60.16(VCC) U93.5(VCC) U94.5(VCC)
cTI_TCK: R195.1 U60.3(1B2)
JTAG_cTI_RTCK: J25.9 R491.1 R636.1 R637.1
JTAG_cTI_TCK: J25.11 R188.1 R190.1 U53.2(B) U93.2(B)
JTAG_EMU0: J25.13 U48.8(B1) ; off-sheet JTAG_EMU0
JTAG_EMU1: J25.14 U48.1(B2) ; off-sheet JTAG_EMU1
JTAG_EMU_RSTn: J25.15 R150.2 R449.1 ; off-sheet JTAG_EMU_RSTn
JTAG_MIPI_EMU0: J33.38 R461.2 U48.5(A1)
JTAG_MIPI_EMU1: J33.40 R460.2 U48.4(A2)
JTAG_MIPI_RTCK: J33.7 R492.1 R638.1 R639.1
JTAG_MIPI_TCK: J33.3 R187.1 R189.1 U52.2(B) U94.2(B)
JTAG_MUX_SEL: J29.2 U60.1(S)
JTAG_TCK: U60.4(1A) ; off-sheet JTAG_TCK
JTAG_TDI: J25.3 R410.2 ; off-sheet JTAG_TDI
JTAG_TDIS: J25.4 R177.2
JTAG_TDO: J25.7 R450.1 ; off-sheet JTAG_TDO
JTAG_TMS: J25.1 R451.1 ; off-sheet JTAG_TMS
JTAG_TRST#: C529.2 R448.1 R685.2 ; off-sheet JTAG_TRST#
MIPI_TCK: R194.1 U60.2(1B1)
MIPI_TDI_R: J33.5 R410.1
MIPI_TDO_R: J33.4 R450.2
MIPI_TMS_R: J33.2 R451.2
MIPI_TRC_CLK: J33.13 ; off-sheet MIPI_TRC_CLK
MIPI_TRC_CTL: J33.17 ; off-sheet MIPI_TRC_CTL
MIPI_TRC_DAT00: J33.19 ; off-sheet MIPI_TRC_DAT00
MIPI_TRC_DAT01: J33.21 ; off-sheet MIPI_TRC_DAT01
MIPI_TRC_DAT02: J33.23 ; off-sheet MIPI_TRC_DAT02
MIPI_TRC_DAT03: J33.25 ; off-sheet MIPI_TRC_DAT03
MIPI_TRC_DAT04: J33.27 ; off-sheet MIPI_TRC_DAT04
MIPI_TRC_DAT05: J33.29 ; off-sheet MIPI_TRC_DAT05
MIPI_TRC_DAT06: J33.31 ; off-sheet MIPI_TRC_DAT06
MIPI_TRC_DAT07: J33.33 ; off-sheet MIPI_TRC_DAT07
MIPI_TRC_DAT08: J33.35 ; off-sheet MIPI_TRC_DAT08
MIPI_TRC_DAT09: J33.37 ; off-sheet MIPI_TRC_DAT09
MIPI_TRC_DAT10: J33.39 ; off-sheet MIPI_TRC_DAT10
MIPI_TRC_DAT11: J33.41 ; off-sheet MIPI_TRC_DAT11
MIPI_TRC_DAT12: J33.43 ; off-sheet MIPI_TRC_DAT12
MIPI_TRC_DAT13: J33.45 ; off-sheet MIPI_TRC_DAT13
MIPI_TRC_DAT14: J33.47 ; off-sheet MIPI_TRC_DAT14
MIPI_TRC_DAT15: J33.49 ; off-sheet MIPI_TRC_DAT15
MIPI_TRC_DAT16: J33.51 ; off-sheet MIPI_TRC_DAT16
MIPI_TRC_DAT17: J33.53 ; off-sheet MIPI_TRC_DAT17
MIPI_TRC_DAT18: J33.55 ; off-sheet MIPI_TRC_DAT18
MIPI_TRC_DAT19: J33.18 ; off-sheet MIPI_TRC_DAT19
MIPI_TRC_DAT20: J33.20 ; off-sheet MIPI_TRC_DAT20
MIPI_TRC_DAT21: J33.22 ; off-sheet MIPI_TRC_DAT21
MIPI_TRC_DAT22: J33.24 ; off-sheet MIPI_TRC_DAT22
MIPI_TRC_DAT23: J33.26 ; off-sheet MIPI_TRC_DAT23
MIPI_TRST#_R: J33.8 R448.2
SEL_XDS110_INV: J25.8 J33.58 U52.1(A) U53.1(A) U60.15(~{OE}) U93.1(A) U94.1(A) ; off-sheet SEL_XDS110_INV
VCC3V3_R: J33.1 R411.1
NetC168_1: C168.1 R189.2
NetC169_1: C169.1 R190.2
NetJ25_2: J25.2 R685.1
NetJ33_6: J33.6 R449.2
NetJ33_12: J33.12 R447.2
NetJ33_15: J33.15 R409.2
NetR194_2: R194.2 U52.4(Y)
NetR195_2: R195.2 U53.4(Y)
NetR459_1: R459.1 U48.6(OE)
NetR491_2: R491.2 U93.4(Y)
NetR492_2: R492.2 U94.4(Y)

Not connected (* = marked no-connect by the designer): J25 17* 18* 19*; J33 9* 10* 11* 14* 28* 30* 32* 34* 36* 42* 44* 46* 48* 50* 52* 54* 56* 59* 60*; U60 5(2B1)* 6(2B2)* 10(3B2)* 11(3B1)* 13(4B2)* 14(4B1)*

### Notes on the sheet
- MIPI 60 PIN CONNECTOR
- JTAG 20 PIN cTI CONNECTOR
- D-Note :-
  Place pulls on the JTAG signals near to the SoC
  Refer SoC data sheet for Pin Connectivity
  Requirements
- D-Note :-
  Add an external ESD protection to provide system
  level ESD protection
  when external connector is used for debug
  Follow the connectivity table for connecting the
  required pulls for the SOC JTAG interface
  Add Test points, and external  ESD protection when
  JTAG connector is not used
- D-Note :-
  TRSTn is the reset to the JTAG logic.  For normal operation,
  this is pulled low, and thus the JTAG remains in reset as it is
  not being used. When a JTAG pod is connected, the pod will
  eventually drive this signal high to release the JTAG logic from
  reset and enable a JTAG connection.
- Off Page Connections
- From JTAG Buffer
- From SoC GPMC
- It should be connected to PORz of the SoC TBD
- (in symbol MISTRAL_TITLEBLK_CSIZE) Title; Designed for TI by Mistral Solutions Pvt Ltd; Size; Rev; Date:; Sheet; of

### Library data of the parts
*#24 = MISTRAL_TITLEBLK_CSIZE: Issue: 1.0; Page Create Date: March  8, 1995; Page Modify Date: *
C144 C163 C164 C194 C411 = CAP_Dup3: as C192 on sheet 22; Footprint Path: Y:\MIS_DATABASE\Library\ALTIUM_TOOL\PCB_FOOTPRINTS\Altium_Footprint_Lib.PcbLib; Library Path: Y:\MIS_DATABASE\Library\ALTIUM_TOOL\SCHEMATICS_PARTS\MS_DISCRETE_Library.schlib; Footprint Ref: CAP0402_0-75; Library Ref: CAP; MECHANICAL 3D STEP FILE: CAP0402_0-75; Chkd/date: MANIRAJA/170820; Crtd /date: ALVY/170820; Datasheet: Y:\MIS_DATABASE\DATASHEETS\CAPACITORS\885012105018.PDF; Temperature: -55癈+85癈; Weight: 0.65mg; Height: 0.55MM; Distributor_part_number: 732-7495-1-ND; Distributor_name: DIGIKEY; Package: 0402; Tolerance: 20%; PCB Footprint: CAP0402_0-75
C168 = CAP_Dup3: CAP CERAMIC 8.2pF 100V 0.5pF C0G(NP0) 0402; Part_type: CAPACITORS\CERAMIC; Mfr_part_number: 885012005085; Mfr_name: WURTH ELECTRONICS; Mistral Part No: 120020080006-R; Wattage: NA; Custom_Duty: 15%; Customs_HS_Code: 85322990; Tolerance: 0.5pF%; Project: AM64x_EVM_BRD; PCB Footprint: CAP0402_0-75; Footprint Path: Y:\MIS_DATABASE\Library\ALTIUM_TOOL\PCB_FOOTPRINTS\Altium_Footprint_Lib.PcbLib; Library Path: Y:\MIS_DATABASE\Library\ALTIUM_TOOL\SCHEMATICS_PARTS\MS_DISCRETE_Library.schlib; Footprint Ref: CAP0402_0-75; Library Ref: CAP; MECHANICAL 3D STEP FILE: CAP0402_0-75; Chkd/date: MANIRAJA/170820; Crtd /date: ALVY/170820; Datasheet: Y:\MIS_DATABASE\DATASHEETS\CAPACITORS\885012005085.PDF; Temperature: -55癈+125癈; Weight: 2.261mg; Height: 0.55MM; Distributor_part_number: 732-12053-1-ND; Distributor_name: DIGIKEY; Package: 0402
C169 = CAP_Dup3: CAP CERAMIC 8.2pF 100V 0.5pF C0G(NP0) 0402; Mistral Part No: 120020080006-R; Mfr_name: WURTH ELECTRONICS; Mfr_part_number: 885012005085; Part_type: CAPACITORS\CERAMIC; Project: AM64x_EVM_BRD; Tolerance: 0.5pF%; Customs_HS_Code: 85322990; Custom_Duty: 15%; Wattage: NA; PCB Footprint: CAP0402_0-75; Package: 0402; Distributor_name: DIGIKEY; Distributor_part_number: 732-12053-1-ND; Height: 0.55MM; Weight: 2.261mg; Temperature: -55癈+125癈; Datasheet: Y:\MIS_DATABASE\DATASHEETS\CAPACITORS\885012005085.PDF; Crtd /date: ALVY/170820; Chkd/date: MANIRAJA/170820; MECHANICAL 3D STEP FILE: CAP0402_0-75; Library Ref: CAP; Footprint Ref: CAP0402_0-75; Library Path: Y:\MIS_DATABASE\Library\ALTIUM_TOOL\SCHEMATICS_PARTS\MS_DISCRETE_Library.schlib; Footprint Path: Y:\MIS_DATABASE\Library\ALTIUM_TOOL\PCB_FOOTPRINTS\Altium_Footprint_Lib.PcbLib
C182 C183 C457 = CAP_Dup2: as C176 on sheet 22; Footprint Path: Y:\MIS_DATABASE\Library\ALTIUM_TOOL\PCB_FOOTPRINTS\Altium_Footprint_Lib.PcbLib; Library Path: Y:\MIS_DATABASE\Library\ALTIUM_TOOL\SCHEMATICS_PARTS\MS_DISCRETE_Library.schlib; Footprint Ref: CAP0402_0-75; MECHANICAL 3D STEP FILE: CAP0402_0-75; Temperature: -55癈+125癈; Weight: 0.65mg; Chkd/date: MANIRAJA/170820; Crtd /date: ALVY/170820; Datasheet: Y:\MIS_DATABASE\DATASHEETS\CAPACITORS\885012205050.PDF; Height: 0.55MM; Distributor_part_number: 732-7545-1-ND; Distributor_name: DIGIKEY; Package: 0402; Tolerance: 10%; Library Ref: CAP
C456 = CAP_Dup2: as C166 on sheet 22; Library Ref: CAP; Tolerance: 10%; Package: 0402; Distributor_name: DIGIKEY; Distributor_part_number: 732-7545-1-ND; Height: 0.55MM; Datasheet: Y:\MIS_DATABASE\DATASHEETS\CAPACITORS\885012205050.PDF; Crtd /date: ALVY/170820; Chkd/date: MANIRAJA/170820; Weight: 0.65mg; Temperature: -55癈+125癈; MECHANICAL 3D STEP FILE: CAP0402_0-75; Footprint Ref: CAP0402_0-75; Library Path: Y:\MIS_DATABASE\Library\ALTIUM_TOOL\SCHEMATICS_PARTS\MS_DISCRETE_Library.schlib; Footprint Path: Y:\MIS_DATABASE\Library\ALTIUM_TOOL\PCB_FOOTPRINTS\Altium_Footprint_Lib.PcbLib
C529 = CAP_Dup3: as C185 on sheet 22; Tolerance: 20%; Package: 0402; Distributor_name: DIGIKEY; Distributor_part_number: 732-7495-1-ND; Height: 0.55MM; Weight: 0.65mg; Temperature: -55癈+85癈; Datasheet: Y:\MIS_DATABASE\DATASHEETS\CAPACITORS\885012105018.PDF; Crtd /date: ALVY/170820; Chkd/date: MANIRAJA/170820; MECHANICAL 3D STEP FILE: CAP0402_0-75; Library Ref: CAP; Footprint Ref: CAP0402_0-75; Library Path: Y:\MIS_DATABASE\Library\ALTIUM_TOOL\SCHEMATICS_PARTS\MS_DISCRETE_Library.schlib; Footprint Path: Y:\MIS_DATABASE\Library\ALTIUM_TOOL\PCB_FOOTPRINTS\Altium_Footprint_Lib.PcbLib; PCB Footprint: CAP0402_0-75
FB21 = INDUCTOR_FERRITE: as FB8 on sheet 22; Footprint Path: Y:\MIS_DATABASE\Library\ALTIUM_TOOL\PCB_FOOTPRINTS\Altium_Footprint_Lib.PcbLib; Library Path: Y:\MIS_DATABASE\Library\ALTIUM_TOOL\SCHEMATICS_PARTS\MS_FILTER_Library.schlib; MECHANICAL 3D STEP FILE: IND0603_1; Chkd/date: MANIRAJA/180820; Crtd /date: ALVY/180820; Datasheet: Y:\MIS_DATABASE\DATASHEETS\DISCRETES\INDUCTORS\782631141.PDF; Temperature: -55癈+125癈; Weight: NA; Height: 1.00MM; Library Ref: INDUCTOR_FERRITE; Distributor_part_number: 732-782631141CT-ND; Distributor_name: DIGIKEY; Package: 0603; Voltage: NA; Part_type: INDUCTOR; Footprint Ref: IND0603_1; PCB Footprint: IND0603_1
J25 = HEADER_10X2_FTR-06: CON HDR 2X10 1.27MM PITCH ST SMD; Mistral Part No: 150011090001-R; Mfr_name: SAMTEC; Mfr_part_number: FTR-110-51-S-D-06; Part_type: CONNECTOR\HEADERS; Project: GEMYC; Tolerance: NA; Customs_HS_Code: 85369090; Custom_Duty: 24%; Footprint Ref: HDR_2X10_FTR-110-51-D-06_S_S_8-7; Voltage: NA; Wattage: NA; Package: SMD; Distributor_name: DIGIKEY; Distributor_part_number: SAM8792-ND; Library Ref: HEADER_10X2_FTR-06; Height: 8.67MM; Weight: NA; Temperature: -55癈+125癈; Datasheet: Y:\MIS_DATABASE\DATASHEETS\CONNECTORS\FTR-D-SER.PDF; Crtd /date: CHAITHANYA/050811; Chkd/date: MANIRAJA/031218; MECHANICAL 3D STEP FILE: HDR_2X10_FTR-110-51-D-06_S_S_8-7; Library Path: Y:\MIS_DATABASE\Library\ALTIUM_TOOL\SCHEMATICS_PARTS\MS_CONNECTOR_Library.schlib; Footprint Path: Y:\MIS_DATABASE\Library\ALTIUM_TOOL\PCB_FOOTPRINTS\Altium_Footprint_Lib.PcbLib; PCB Footprint: HDR_2X10_FTR-110-51-D-06_S_S_8-7
J29 = HEADER_3X1: HDR 1X3 2.54MM PITCH ST TH; Part_type: CONNECTOR\HEADERS; Mfr_part_number: 68001-403HLF; Mfr_name: FCI; Mistral Part No: 150016060025-R; Custom_Duty: 15%; Customs_HS_Code: 85322990; Wattage: NA; Project: IKEYP; Library Ref: HEADER_3X1; Chkd/date: VASANTHA/290616; Crtd /date: VASANTHA/290616; Datasheet: Y:\MIS_DATABASE\DATASHEETS\CONNECTORS\68000.PDF; Temperature: -40癈+105癈; Weight: NA; Height: 8.58MM; Distributor_part_number: 609-3471-ND; Distributor_name: DIGIKEY; Package: THRU-HOLE; Voltage: NA; Tolerance: NA; PCB Footprint: HDR_3X1_100_S_T
J33 = CON_PMC_30X2_F: CON PMC 2X30 0.50MM PITCH FEMALE ST SMD; Part_type: CONNECTOR\PMC; Mfr_name: SAMTEC; Mistral Part No: 150009030606-R; Wattage: NA; Custom_Duty: 24%; Customs_HS_Code: 85369090; Project: KHAN_HSST; PCB Footprint: CON_PMC2X30_QSH-030-01-D-A_S_S_S_3-3; Footprint Path: Y:\MIS_DATABASE\Library\ALTIUM_TOOL\PCB_FOOTPRINTS\Altium_Footprint_Lib.PcbLib; Library Path: Y:\MIS_DATABASE\Library\ALTIUM_TOOL\SCHEMATICS_PARTS\MS_CONNECTOR_Library.schlib; MECHANICAL 3D STEP FILE: CON_PMC2X30_QSH-030-01-D-A_S_S_S_3-3; Temperature: -55癈+125癈; Weight: NA; Distributor_part_number: SAM8180-ND; Distributor_name: DIGIKEY; Voltage: NA; Tolerance: NA; Footprint Ref: CON_PMC2X30_QSH-030-01-D-A_S_S_S_3-3; Chkd/date: MANIRAJA/011018; Crtd /date: USMAN/051108; Datasheet: Y:\MIS_DATABASE\DATASHEETS\CONNECTORS\QSH.PDF; Height: 3.25MM; Package: SMD; Library Ref: CON_PMC_30X2_F_4SH
R150 R460 = RESISTOR_Dup4: as R202 on sheet 22; Footprint Path: Y:\MIS_DATABASE\Library\ALTIUM_TOOL\PCB_FOOTPRINTS\Altium_Footprint_Lib.PcbLib; Library Path: Y:\MIS_DATABASE\Library\ALTIUM_TOOL\SCHEMATICS_PARTS\MS_DISCRETE_Library.schlib; MECHANICAL 3D STEP FILE: RES0402_0-5; Footprint Ref: RES0402_0-5; Library Ref: RESISTOR; Tolerance: 5%; Wattage: 1/16W; Package: 0402; Distributor_name: DIGIKEY; Distributor_part_number: 311-4.7KJRCT-ND; Height: 0.40MM; Weight: 0.65mg; Temperature: -55癈+155癈; Datasheet: Y:\MIS_DATABASE\DATASHEETS\RESISTORS\RCXXXXL-SER_MAR18.PDF; Crtd /date: VASANTHA/130516; Chkd/date: VASANTHA/130516; PCB Footprint: RES0402_0-5
R177 = RESISTOR_Dup5: as R478 on sheet 22; Footprint Path: Y:\MIS_DATABASE\Library\ALTIUM_TOOL\PCB_FOOTPRINTS\Altium_Footprint_Lib.PcbLib; Library Path: Y:\MIS_DATABASE\Library\ALTIUM_TOOL\SCHEMATICS_PARTS\MS_DISCRETE_Library.schlib; Footprint Ref: RES0402_0-5; Library Ref: RESISTOR; MECHANICAL 3D STEP FILE: RES0402_0-5; Chkd/date: VASANTHA/201216; Crtd /date: MUDDU/190810; Datasheet: Y:\MIS_DATABASE\DATASHEETS\RESISTORS\CRCW0603.PDF; Temperature: -55癈+155癈; Weight: 0.65mg; Height: 0.40MM; Distributor_part_number: 541-0.0JCT-ND; Distributor_name: DIGIKEY; Package: 0402; Wattage: 1/16W; Tolerance: NA; PCB Footprint: RES0402_0-5
R187 R639 = RESISTOR_Dup6: as R198 on sheet 22; Footprint Path: Y:\MIS_DATABASE\Library\ALTIUM_TOOL\PCB_FOOTPRINTS\Altium_Footprint_Lib.PcbLib; Library Path: Y:\MIS_DATABASE\Library\ALTIUM_TOOL\SCHEMATICS_PARTS\MS_DISCRETE_Library.schlib; Footprint Ref: RES0402_0-5; Library Ref: RESISTOR; Tolerance: 5%; Wattage: 1/16W; Package: 0402; Distributor_name: DIGIKEY; Distributor_part_number: 311-10KJRCT-ND; Height: 0.40MM; Weight: 0.65mg; Temperature: -55癈+155癈; Datasheet: Y:\MIS_DATABASE\DATASHEETS\RESISTORS\RCXXXXL-SER_MAR18.PDF; Crtd /date: MAZHAR/230805; Chkd/date: VASANTHA/061216; MECHANICAL 3D STEP FILE: RES0402_0-5; PCB Footprint: RES0402_0-5
R188 R459 R637 = RESISTOR_Dup6: as R199 on sheet 22; MECHANICAL 3D STEP FILE: RES0402_0-5; Chkd/date: VASANTHA/061216; Crtd /date: MAZHAR/230805; Datasheet: Y:\MIS_DATABASE\DATASHEETS\RESISTORS\RCXXXXL-SER_MAR18.PDF; Temperature: -55癈+155癈; Weight: 0.65mg; Height: 0.40MM; Distributor_part_number: 311-10KJRCT-ND; Distributor_name: DIGIKEY; Package: 0402; Wattage: 1/16W; Tolerance: 5%; Library Ref: RESISTOR; Footprint Ref: RES0402_0-5; Library Path: Y:\MIS_DATABASE\Library\ALTIUM_TOOL\SCHEMATICS_PARTS\MS_DISCRETE_Library.schlib; Footprint Path: Y:\MIS_DATABASE\Library\ALTIUM_TOOL\PCB_FOOTPRINTS\Altium_Footprint_Lib.PcbLib; PCB Footprint: RES0402_0-5
R189 R190 R638 = RESISTOR_Dup6: RES 100E 1/16W 5% 0402; Part_type: RESISTORS\FIXED; Mfr_part_number: CRCW0402100RJNED; Mfr_name: VISHAY; Mistral Part No: 110014060039-R; Custom_Duty: 15%; Customs_HS_Code: 85332119; Voltage: NA; Project: TI_MAXIE_CPB; PCB Footprint: RES0402_0-5; MECHANICAL 3D STEP FILE: RES0402_0-5; Chkd/date: MANIRAJA/230817; Crtd /date: MANIRAJA/230817; Datasheet: Y:\MIS_DATABASE\DATASHEETS\RESISTORS\CRCW0603.PDF; Temperature: -55癈+155癈; Weight: 0.65mg; Height: 0.40MM; Distributor_part_number: 541-100JCT-ND; Distributor_name: DIGIKEY; Package: 0402; Wattage: 1/16W; Tolerance: 5%; Library Ref: RESISTOR; Footprint Ref: RES0402_0-5; Library Path: Y:\MIS_DATABASE\Library\ALTIUM_TOOL\SCHEMATICS_PARTS\MS_DISCRETE_Library.schlib; Footprint Path: Y:\MIS_DATABASE\Library\ALTIUM_TOOL\PCB_FOOTPRINTS\Altium_Footprint_Lib.PcbLib
R194 R492 = RESISTOR_Dup6: RES 33E 1/10W 1% 0402; Part_type: RESISTORS\FIXED; Mfr_part_number: ERJ-2RKF33R0X; Mfr_name: PANASONIC-ECG; Mistral Part No: 110014110006-R; Custom_Duty: 15%; Customs_HS_Code: 85332119; Voltage: NA; Project: ZK BIOMETRIC; PCB Footprint: RES0402_0-5; MECHANICAL 3D STEP FILE: RES0402_0-5; Chkd/date: VASANTHA/061216; Crtd /date: JEBRAN/171114; Datasheet: Y:\MIS_DATABASE\DATASHEETS\RESISTORS\PAN-ERJSER_NOV17.PDF; Temperature: -55癈+155癈; Weight: 0.8mg; Height: 0.40MM; Distributor_part_number: P33.0LCT-ND; Distributor_name: DIGIKEY; Package: 0402; Wattage: 1/10W; Tolerance: 1%; Library Ref: RESISTOR; Footprint Ref: RES0402_0-5; Library Path: Y:\MIS_DATABASE\Library\ALTIUM_TOOL\SCHEMATICS_PARTS\MS_DISCRETE_Library.schlib; Footprint Path: Y:\MIS_DATABASE\Library\ALTIUM_TOOL\PCB_FOOTPRINTS\Altium_Footprint_Lib.PcbLib
R195 R491 = RESISTOR_Dup6: RES 33E 1/10W 1% 0402; Mistral Part No: 110014110006-R; Mfr_name: PANASONIC-ECG; Mfr_part_number: ERJ-2RKF33R0X; Part_type: RESISTORS\FIXED; Project: ZK BIOMETRIC; Voltage: NA; Customs_HS_Code: 85332119; Custom_Duty: 15%; Footprint Path: Y:\MIS_DATABASE\Library\ALTIUM_TOOL\PCB_FOOTPRINTS\Altium_Footprint_Lib.PcbLib; Library Path: Y:\MIS_DATABASE\Library\ALTIUM_TOOL\SCHEMATICS_PARTS\MS_DISCRETE_Library.schlib; Footprint Ref: RES0402_0-5; Library Ref: RESISTOR; Tolerance: 1%; Wattage: 1/10W; Package: 0402; Distributor_name: DIGIKEY; Distributor_part_number: P33.0LCT-ND; Height: 0.40MM; Weight: 0.8mg; Temperature: -55癈+155癈; Datasheet: Y:\MIS_DATABASE\DATASHEETS\RESISTORS\PAN-ERJSER_NOV17.PDF; Crtd /date: JEBRAN/171114; Chkd/date: VASANTHA/061216; MECHANICAL 3D STEP FILE: RES0402_0-5; PCB Footprint: RES0402_0-5
R409 = RESISTOR_Dup3: RES 0E 1/16W JUMPER 0402; Mistral Part No: 110010080019-R; Mfr_name: VISHAY; Mfr_part_number: CRCW04020000Z0ED; Part_type: RESISTORS\FIXED; MECHANICAL 3D STEP FILE: RES0402_0-5; Voltage: NA; Project: PB_BUGBASE; Customs_HS_Code: 85332119; Custom_Duty: 15%; Footprint Path: Y:\MIS_DATABASE\Library\ALTIUM_TOOL\PCB_FOOTPRINTS\Altium_Footprint_Lib.PcbLib; Library Path: Y:\MIS_DATABASE\Library\ALTIUM_TOOL\SCHEMATICS_PARTS\MS_DISCRETE_Library.schlib; Footprint Ref: RES0402_0-5; Library Ref: RESISTOR; Temperature: -55癈+155癈; Weight: 0.65mg; Tolerance: NA; Wattage: 1/16W; Package: 0402; Distributor_name: DIGIKEY; Distributor_part_number: 541-0.0JCT-ND; Height: 0.40MM; Datasheet: Y:\MIS_DATABASE\DATASHEETS\RESISTORS\CRCW0603.PDF; Crtd /date: MUDDU/190810; Chkd/date: VASANTHA/201216; PCB Footprint: RES0402_0-5
R410 = RESISTOR_Dup3: RES 10E 1/16W 1% 0402; Mistral Part No: 110018020004-R; Mfr_name: YAGEO AMERICA; Mfr_part_number: RC0402FR-0710RL; Part_type: RESISTORS\FIXED; MECHANICAL 3D STEP FILE: RES0402_0-5; Voltage: NA; Project: TI_MAXIE_CPB; Customs_HS_Code: 85332119; Custom_Duty: 15%; Library Ref: RESISTOR; Temperature: -55癈+155癈; Weight: 0.65mg; Tolerance: 1%; Wattage: 1/16W; Package: 0402; Distributor_name: DIGIKEY; Distributor_part_number: 311-10.0LRCT-ND; Height: 0.40MM; Datasheet: Y:\MIS_DATABASE\DATASHEETS\RESISTORS\RCXXXXL-SER_MAR18.PDF; Crtd /date: ALVY/070218; Chkd/date: MANIRAJA/070218; PCB Footprint: RES0402_0-5; Footprint Ref: RES0402_0-5; Library Path: Y:\MIS_DATABASE\Library\ALTIUM_TOOL\SCHEMATICS_PARTS\MS_DISCRETE_Library.schlib; Footprint Path: Y:\MIS_DATABASE\Library\ALTIUM_TOOL\PCB_FOOTPRINTS\Altium_Footprint_Lib.PcbLib
R411 R685 = RESISTOR_Dup2: RES 100E 1/16W 5% 0402; Part_type: RESISTORS\FIXED; Mfr_part_number: CRCW0402100RJNED; Mfr_name: VISHAY; Mistral Part No: 110014060039-R; MECHANICAL 3D STEP FILE: RES0402_0-5; Custom_Duty: 15%; Customs_HS_Code: 85332119; Voltage: NA; Project: TI_MAXIE_CPB; Library Ref: RESISTOR; Chkd/date: MANIRAJA/230817; Crtd /date: MANIRAJA/230817; Datasheet: Y:\MIS_DATABASE\DATASHEETS\RESISTORS\CRCW0603.PDF; Temperature: -55癈+155癈; Weight: 0.65mg; Height: 0.40MM; Distributor_part_number: 541-100JCT-ND; Distributor_name: DIGIKEY; Package: 0402; Wattage: 1/16W; Tolerance: 5%; PCB Footprint: RES0402_0-5; Footprint Ref: RES0402_0-5; Library Path: Y:\MIS_DATABASE\Library\ALTIUM_TOOL\SCHEMATICS_PARTS\MS_DISCRETE_Library.schlib; Footprint Path: Y:\MIS_DATABASE\Library\ALTIUM_TOOL\PCB_FOOTPRINTS\Altium_Footprint_Lib.PcbLib
R447 = RESISTOR_Dup2: RES 100E 1/16W 5% 0402; Mistral Part No: 110014060039-R; Mfr_name: VISHAY; Mfr_part_number: CRCW0402100RJNED; Part_type: RESISTORS\FIXED; Project: TI_MAXIE_CPB; Voltage: NA; Customs_HS_Code: 85332119; Custom_Duty: 15%; MECHANICAL 3D STEP FILE: RES0402_0-5; Tolerance: 5%; Wattage: 1/16W; Package: 0402; Distributor_name: DIGIKEY; Distributor_part_number: 541-100JCT-ND; Height: 0.40MM; Weight: 0.65mg; Temperature: -55癈+155癈; Datasheet: Y:\MIS_DATABASE\DATASHEETS\RESISTORS\CRCW0603.PDF; Crtd /date: MANIRAJA/230817; Chkd/date: MANIRAJA/230817; Library Ref: RESISTOR; PCB Footprint: RES0402_0-5; Footprint Ref: RES0402_0-5; Library Path: Y:\MIS_DATABASE\Library\ALTIUM_TOOL\SCHEMATICS_PARTS\MS_DISCRETE_Library.schlib; Footprint Path: Y:\MIS_DATABASE\Library\ALTIUM_TOOL\PCB_FOOTPRINTS\Altium_Footprint_Lib.PcbLib
R448 = RESISTOR_Dup2: RES 100E 1/16W 5% 0402; Part_type: RESISTORS\FIXED; Mfr_part_number: CRCW0402100RJNED; Mfr_name: VISHAY; Mistral Part No: 110014060039-R; PCB Footprint: RES0402_0-5; Custom_Duty: 15%; Customs_HS_Code: 85332119; Voltage: NA; Project: TI_MAXIE_CPB; Footprint Path: Y:\MIS_DATABASE\Library\ALTIUM_TOOL\PCB_FOOTPRINTS\Altium_Footprint_Lib.PcbLib; Library Path: Y:\MIS_DATABASE\Library\ALTIUM_TOOL\SCHEMATICS_PARTS\MS_DISCRETE_Library.schlib; Footprint Ref: RES0402_0-5; Library Ref: RESISTOR; MECHANICAL 3D STEP FILE: RES0402_0-5; Chkd/date: MANIRAJA/230817; Crtd /date: MANIRAJA/230817; Datasheet: Y:\MIS_DATABASE\DATASHEETS\RESISTORS\CRCW0603.PDF; Temperature: -55癈+155癈; Weight: 0.65mg; Height: 0.40MM; Distributor_part_number: 541-100JCT-ND; Distributor_name: DIGIKEY; Package: 0402; Wattage: 1/16W; Tolerance: 5%
R449 R451 = RESISTOR_Dup3: RES 10E 1/16W 1% 0402; Part_type: RESISTORS\FIXED; Mfr_part_number: RC0402FR-0710RL; Mfr_name: YAGEO AMERICA; Mistral Part No: 110018020004-R; Custom_Duty: 15%; Customs_HS_Code: 85332119; Project: TI_MAXIE_CPB; Voltage: NA; MECHANICAL 3D STEP FILE: RES0402_0-5; Chkd/date: MANIRAJA/070218; Crtd /date: ALVY/070218; Datasheet: Y:\MIS_DATABASE\DATASHEETS\RESISTORS\RCXXXXL-SER_MAR18.PDF; Height: 0.40MM; Distributor_part_number: 311-10.0LRCT-ND; Distributor_name: DIGIKEY; Package: 0402; Wattage: 1/16W; Tolerance: 1%; Weight: 0.65mg; Temperature: -55癈+155癈; Library Ref: RESISTOR; PCB Footprint: RES0402_0-5; Footprint Ref: RES0402_0-5; Library Path: Y:\MIS_DATABASE\Library\ALTIUM_TOOL\SCHEMATICS_PARTS\MS_DISCRETE_Library.schlib; Footprint Path: Y:\MIS_DATABASE\Library\ALTIUM_TOOL\PCB_FOOTPRINTS\Altium_Footprint_Lib.PcbLib
R450 = RESISTOR_Dup3: RES 10E 1/16W 1% 0402; Mistral Part No: 110018020004-R; Mfr_name: YAGEO AMERICA; Mfr_part_number: RC0402FR-0710RL; Part_type: RESISTORS\FIXED; Project: TI_MAXIE_CPB; Customs_HS_Code: 85332119; Custom_Duty: 15%; Voltage: NA; MECHANICAL 3D STEP FILE: RES0402_0-5; Tolerance: 1%; Wattage: 1/16W; Package: 0402; Distributor_name: DIGIKEY; Distributor_part_number: 311-10.0LRCT-ND; Height: 0.40MM; Datasheet: Y:\MIS_DATABASE\DATASHEETS\RESISTORS\RCXXXXL-SER_MAR18.PDF; Crtd /date: ALVY/070218; Chkd/date: MANIRAJA/070218; Weight: 0.65mg; Temperature: -55癈+155癈; Library Ref: RESISTOR; PCB Footprint: RES0402_0-5; Footprint Ref: RES0402_0-5; Library Path: Y:\MIS_DATABASE\Library\ALTIUM_TOOL\SCHEMATICS_PARTS\MS_DISCRETE_Library.schlib; Footprint Path: Y:\MIS_DATABASE\Library\ALTIUM_TOOL\PCB_FOOTPRINTS\Altium_Footprint_Lib.PcbLib
R461 = RESISTOR_Dup4: as R203 on sheet 22; Footprint Path: Y:\MIS_DATABASE\Library\ALTIUM_TOOL\PCB_FOOTPRINTS\Altium_Footprint_Lib.PcbLib; Library Path: Y:\MIS_DATABASE\Library\ALTIUM_TOOL\SCHEMATICS_PARTS\MS_DISCRETE_Library.schlib; MECHANICAL 3D STEP FILE: RES0402_0-5; Footprint Ref: RES0402_0-5; Chkd/date: VASANTHA/130516; Crtd /date: VASANTHA/130516; Datasheet: Y:\MIS_DATABASE\DATASHEETS\RESISTORS\RCXXXXL-SER_MAR18.PDF; Temperature: -55癈+155癈; Weight: 0.65mg; Height: 0.40MM; Distributor_part_number: 311-4.7KJRCT-ND; Distributor_name: DIGIKEY; Package: 0402; Wattage: 1/16W; Tolerance: 5%; Library Ref: RESISTOR; PCB Footprint: RES0402_0-5
R636 = RESISTOR_Dup6: as R467 on sheet 22; Tolerance: 5%; Wattage: 1/16W; Package: 0402; Distributor_name: DIGIKEY; Distributor_part_number: 541-100JCT-ND; Height: 0.40MM; Weight: 0.65mg; Temperature: -55癈+155癈; Datasheet: Y:\MIS_DATABASE\DATASHEETS\RESISTORS\CRCW0603.PDF; Crtd /date: MANIRAJA/230817; Chkd/date: MANIRAJA/230817; MECHANICAL 3D STEP FILE: RES0402_0-5; Library Ref: RESISTOR; Footprint Ref: RES0402_0-5; Library Path: Y:\MIS_DATABASE\Library\ALTIUM_TOOL\SCHEMATICS_PARTS\MS_DISCRETE_Library.schlib; Footprint Path: Y:\MIS_DATABASE\Library\ALTIUM_TOOL\PCB_FOOTPRINTS\Altium_Footprint_Lib.PcbLib; PCB Footprint: RES0402_0-5
U48 = TXS0102DCUR_VSSOP8: as U55 on sheet 23; Footprint Path: Y:\MIS_DATABASE\Library\ALTIUM_TOOL\PCB_FOOTPRINTS\Altium_Footprint_Lib.PcbLib; Library Path: Y:\MIS_DATABASE\Library\ALTIUM_TOOL\SCHEMATICS_PARTS\MS_MISCINTERFACE_Library.schlib; MECHANICAL 3D STEP FILE: VSSOP8_19-68_85X95_0-9; Chkd/date: MANIRAJA/130617; Crtd /date: SHREESHAIL/190108; Datasheet: Y:\MIS_DATABASE\DATASHEETS\ICS\INTERFACE\TXS0102.PDF; Temperature: -40癈+85癈; Weight: 9.6mg; Height: 0.90MM; Distributor_part_number: 296-21931-1-ND; Distributor_name: DIGIKEY; Package: US8; Voltage: NA; Tolerance: NA; Mfr_part_number: TXS0102DCUR; Library Ref: TXS0102DCUR_VSSOP8; Footprint Ref: VSSOP8_19-68_85X95_0-9; PCB Footprint: VSSOP8_19-68_85X95_0-9
U52 U53 U93 U94 = SN74LVC1G32DBVR_SOT23-5: IC SINGAL 2 INPUT POSITIVE OR GATE SOT23-5; Part_type: ICS\DIGITAL\GATES; Mfr_name: TEXAS INSTRUMENTS; Mistral Part No: 141009030236-R; Custom_Duty: 15%; Customs_HS_Code: 85423100; Wattage: NA; Project: SVDO_RMB_MMA; PCB Footprint: SOT23-5_1-5; MECHANICAL 3D STEP FILE: SOT23-5_1-5; Chkd/date: MANIRAJA/051017; Crtd /date: MAZHAR/070806; Datasheet: Y:\MIS_DATABASE\DATASHEETS\ICS\DIGITAL\GATES\SN74LVC1G32.PDF; Temperature: -40癈+85癈; Weight: 6.3mg; Height: 1.45MM; Distributor_part_number: 296-9847-1-ND; Distributor_name: DIGIKEY; Package: SOT23-5; Voltage: NA; Tolerance: NA; Mfr_part_number: SN74LVC1G32DBVR; Library Ref: SN74LVC1G32DBVR_SOT23-5
U60 = SN74CB3Q3257PWR_TSSOP16: IC 4BIT 1-OF-2 FET MULTIPLEXER/DEMULTIPLEXER TSSOP16; Mistral Part No: 141009030117-R; Mfr_name: TEXAS INSTRUMENTS; Part_type: ICS\DIGITAL\COMBINATIONAL; Project: OMAP_EVM; Customs_HS_Code: 85423100; Custom_Duty: 15%; Library Ref: SN74CB3Q3257PWR_TSSOP16; Mfr_part_number: SN74CB3Q3257PWR; Package: TSSOP16; Distributor_name: DIGIKEY; Distributor_part_number: 296-19138-1-ND; Height: 1.20MM; Temperature: -40癈+85癈; Datasheet: Y:\MIS_DATABASE\DATASHEETS\ICS\DIGITAL\COMBINATIONAL\SN74CB3Q3257.PDF; Crtd /date: USMAN/060109; Chkd/date: SUHAS/251010; RoHS: Sb/ Br FREE; PCB Footprint: TSSOP16_25-59_205X180